# EAGLE design wordclock-r2-grid (EAGLE 5.11)
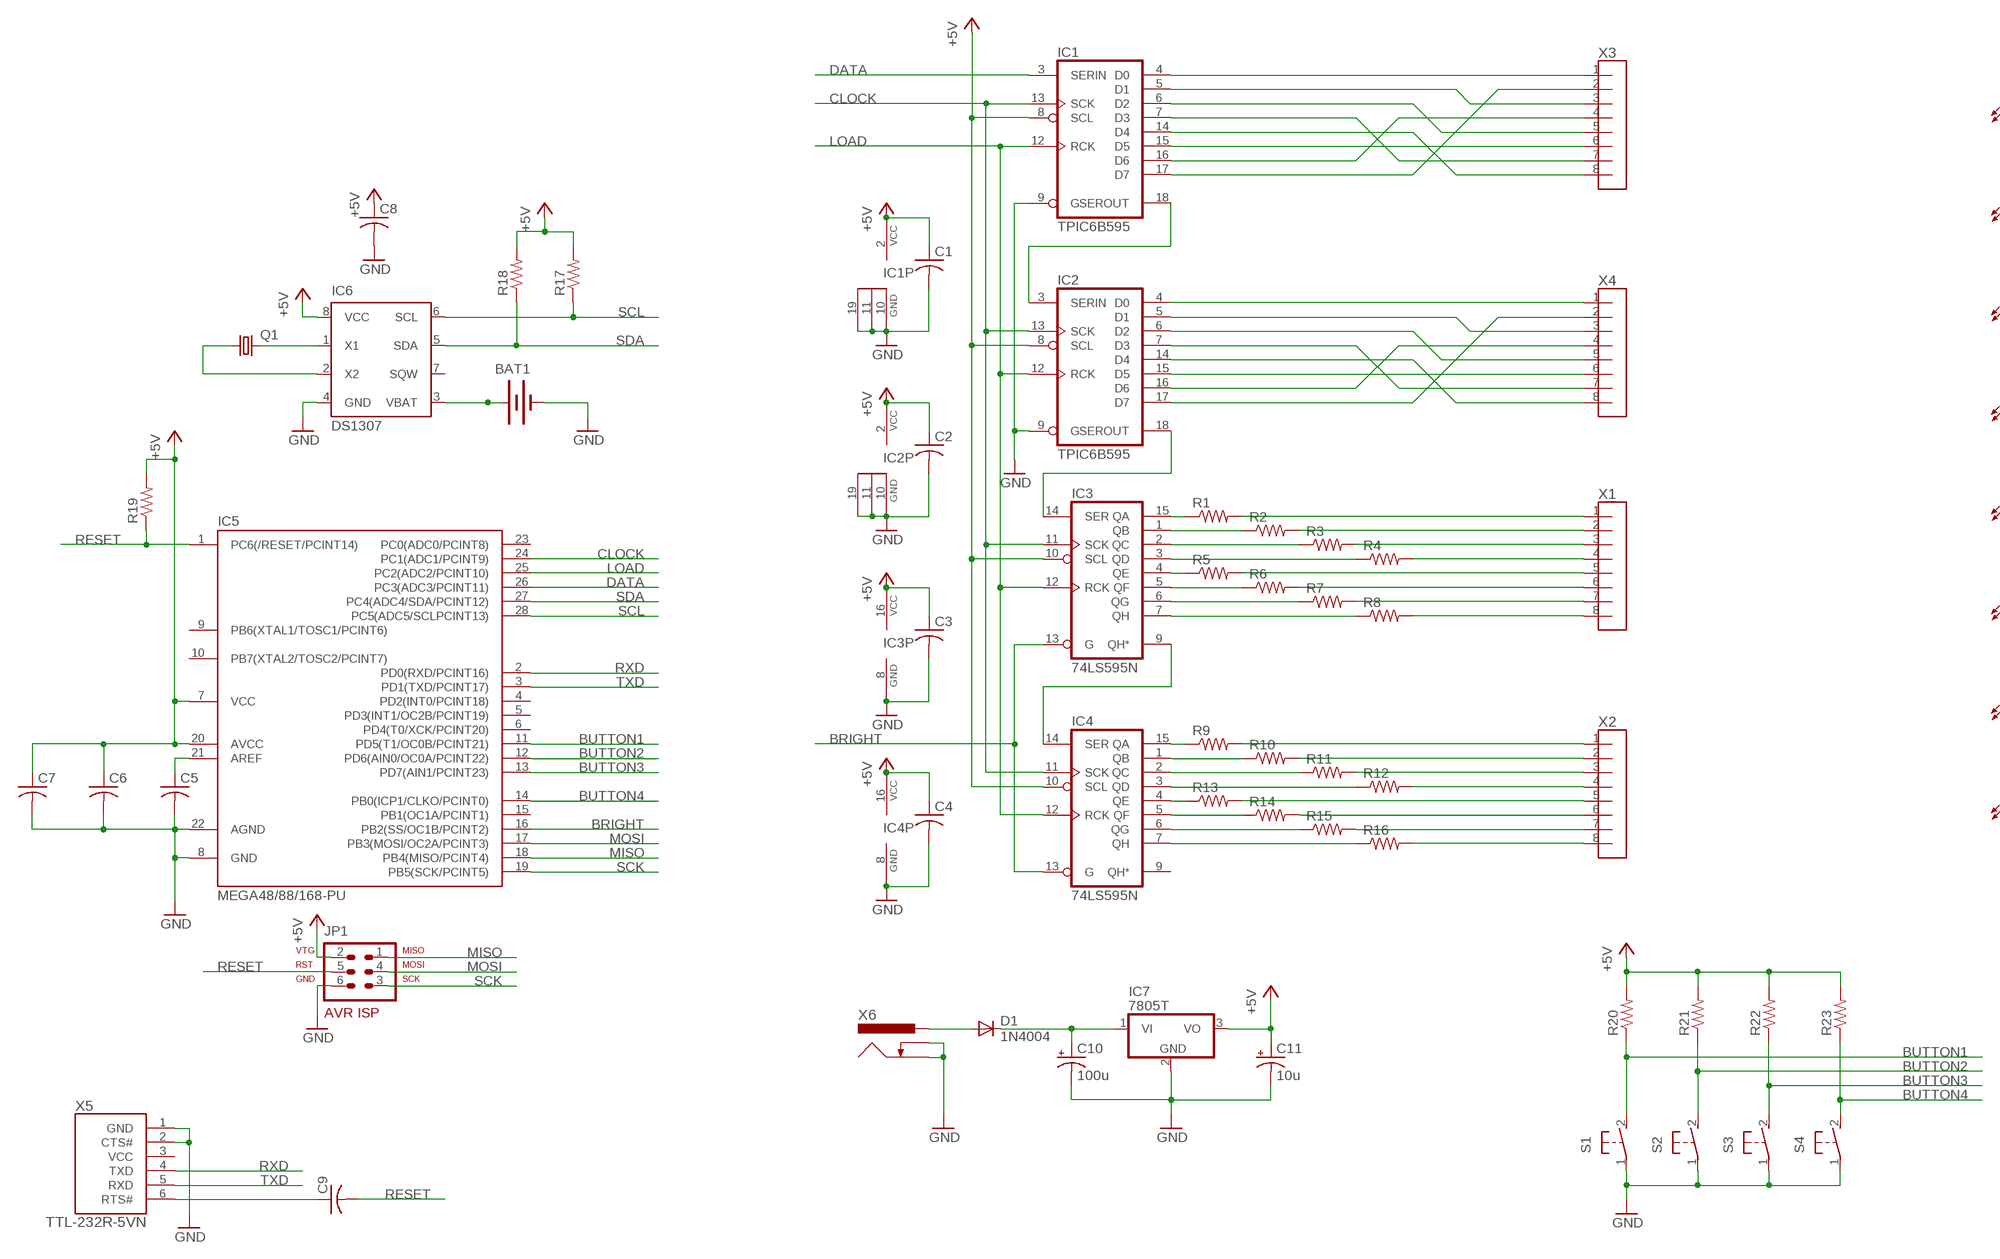
[diagram p0: schematic, sheet 1, part 1 of 2]
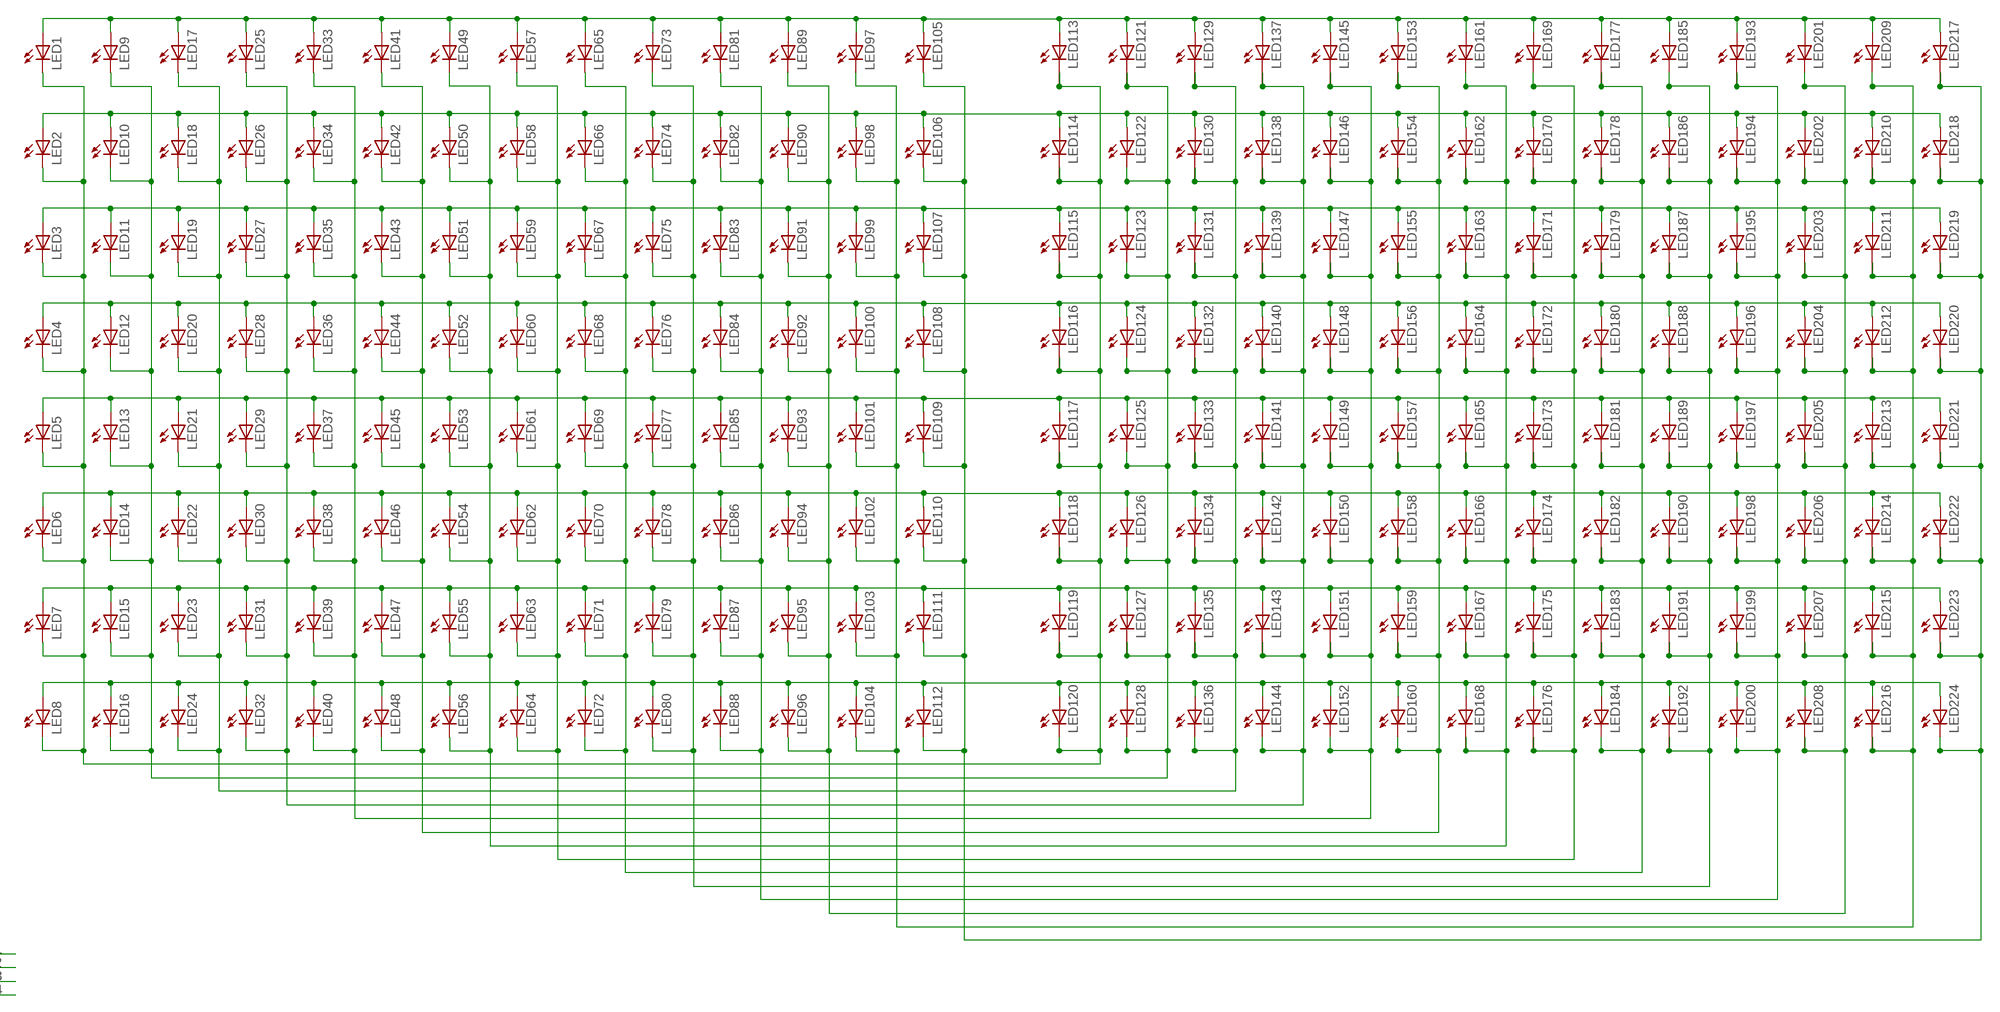
[diagram p1: schematic, sheet 1, part 2 of 2]

## Parts
BAT1  BATTERY12MM  [BATTCON_12MM]
C1  C-US050-025X075  [C050-025X075]
C2  C-US050-025X075  [C050-025X075]
C3  C-US050-025X075  [C050-025X075]
C4  C-US050-025X075  [C050-025X075]
C5  C-US050-025X075  [C050-025X075]
C6  C-US050-025X075  [C050-025X075]
C7  C-US050-025X075  [C050-025X075]
C8  C-US050-025X075  [C050-025X075]
C9  C-US050-025X075  [C050-025X075]
C10  100u  CPOL-USE3.5-8  [E3,5-8]
C11  10u  CPOL-USE2.5-6  [E2,5-6]
D1  1N4004  [DO41-10]
IC1  TPIC6B595  [DIL20]
IC2  TPIC6B595  [DIL20]
IC3  74LS595N  [DIL16]
IC4  74LS595N  [DIL16]
IC5  MEGA48/88/168-PU  [DIL28-3]
IC6  DS1307  [DIL08]
IC7  7805T  [TO220H]
JP1  AVR-ISP-6  [AVR-ISP-6]
LED1  LEDKA-3528ASYC  [KA-3528ASYC]
LED2  LEDKA-3528ASYC  [KA-3528ASYC]
LED3  LEDKA-3528ASYC  [KA-3528ASYC]
LED4  LEDKA-3528ASYC  [KA-3528ASYC]
LED5  LEDKA-3528ASYC  [KA-3528ASYC]
LED6  LEDKA-3528ASYC  [KA-3528ASYC]
LED7  LEDKA-3528ASYC  [KA-3528ASYC]
LED8  LEDKA-3528ASYC  [KA-3528ASYC]
LED9  LEDKA-3528ASYC  [KA-3528ASYC]
LED10  LEDKA-3528ASYC  [KA-3528ASYC]
LED11  LEDKA-3528ASYC  [KA-3528ASYC]
LED12  LEDKA-3528ASYC  [KA-3528ASYC]
LED13  LEDKA-3528ASYC  [KA-3528ASYC]
LED14  LEDKA-3528ASYC  [KA-3528ASYC]
LED15  LEDKA-3528ASYC  [KA-3528ASYC]
LED16  LEDKA-3528ASYC  [KA-3528ASYC]
LED17  LEDKA-3528ASYC  [KA-3528ASYC]
LED18  LEDKA-3528ASYC  [KA-3528ASYC]
LED19  LEDKA-3528ASYC  [KA-3528ASYC]
LED20  LEDKA-3528ASYC  [KA-3528ASYC]
LED21  LEDKA-3528ASYC  [KA-3528ASYC]
LED22  LEDKA-3528ASYC  [KA-3528ASYC]
LED23  LEDKA-3528ASYC  [KA-3528ASYC]
LED24  LEDKA-3528ASYC  [KA-3528ASYC]
LED25  LEDKA-3528ASYC  [KA-3528ASYC]
LED26  LEDKA-3528ASYC  [KA-3528ASYC]
LED27  LEDKA-3528ASYC  [KA-3528ASYC]
LED28  LEDKA-3528ASYC  [KA-3528ASYC]
LED29  LEDKA-3528ASYC  [KA-3528ASYC]
LED30  LEDKA-3528ASYC  [KA-3528ASYC]
LED31  LEDKA-3528ASYC  [KA-3528ASYC]
LED32  LEDKA-3528ASYC  [KA-3528ASYC]
LED33  LEDKA-3528ASYC  [KA-3528ASYC]
LED34  LEDKA-3528ASYC  [KA-3528ASYC]
LED35  LEDKA-3528ASYC  [KA-3528ASYC]
LED36  LEDKA-3528ASYC  [KA-3528ASYC]
LED37  LEDKA-3528ASYC  [KA-3528ASYC]
LED38  LEDKA-3528ASYC  [KA-3528ASYC]
LED39  LEDKA-3528ASYC  [KA-3528ASYC]
LED40  LEDKA-3528ASYC  [KA-3528ASYC]
LED41  LEDKA-3528ASYC  [KA-3528ASYC]
LED42  LEDKA-3528ASYC  [KA-3528ASYC]
LED43  LEDKA-3528ASYC  [KA-3528ASYC]
LED44  LEDKA-3528ASYC  [KA-3528ASYC]
LED45  LEDKA-3528ASYC  [KA-3528ASYC]
LED46  LEDKA-3528ASYC  [KA-3528ASYC]
LED47  LEDKA-3528ASYC  [KA-3528ASYC]
LED48  LEDKA-3528ASYC  [KA-3528ASYC]
LED49  LEDKA-3528ASYC  [KA-3528ASYC]
LED50  LEDKA-3528ASYC  [KA-3528ASYC]
LED51  LEDKA-3528ASYC  [KA-3528ASYC]
LED52  LEDKA-3528ASYC  [KA-3528ASYC]
LED53  LEDKA-3528ASYC  [KA-3528ASYC]
LED54  LEDKA-3528ASYC  [KA-3528ASYC]
LED55  LEDKA-3528ASYC  [KA-3528ASYC]
LED56  LEDKA-3528ASYC  [KA-3528ASYC]
LED57  LEDKA-3528ASYC  [KA-3528ASYC]
LED58  LEDKA-3528ASYC  [KA-3528ASYC]
LED59  LEDKA-3528ASYC  [KA-3528ASYC]
LED60  LEDKA-3528ASYC  [KA-3528ASYC]
LED61  LEDKA-3528ASYC  [KA-3528ASYC]
LED62  LEDKA-3528ASYC  [KA-3528ASYC]
LED63  LEDKA-3528ASYC  [KA-3528ASYC]
LED64  LEDKA-3528ASYC  [KA-3528ASYC]
LED65  LEDKA-3528ASYC  [KA-3528ASYC]
LED66  LEDKA-3528ASYC  [KA-3528ASYC]
LED67  LEDKA-3528ASYC  [KA-3528ASYC]
LED68  LEDKA-3528ASYC  [KA-3528ASYC]
LED69  LEDKA-3528ASYC  [KA-3528ASYC]
LED70  LEDKA-3528ASYC  [KA-3528ASYC]
LED71  LEDKA-3528ASYC  [KA-3528ASYC]
LED72  LEDKA-3528ASYC  [KA-3528ASYC]
LED73  LEDKA-3528ASYC  [KA-3528ASYC]
LED74  LEDKA-3528ASYC  [KA-3528ASYC]
LED75  LEDKA-3528ASYC  [KA-3528ASYC]
LED76  LEDKA-3528ASYC  [KA-3528ASYC]
LED77  LEDKA-3528ASYC  [KA-3528ASYC]
LED78  LEDKA-3528ASYC  [KA-3528ASYC]
LED79  LEDKA-3528ASYC  [KA-3528ASYC]
LED80  LEDKA-3528ASYC  [KA-3528ASYC]
LED81  LEDKA-3528ASYC  [KA-3528ASYC]
LED82  LEDKA-3528ASYC  [KA-3528ASYC]
LED83  LEDKA-3528ASYC  [KA-3528ASYC]
LED84  LEDKA-3528ASYC  [KA-3528ASYC]
LED85  LEDKA-3528ASYC  [KA-3528ASYC]
LED86  LEDKA-3528ASYC  [KA-3528ASYC]
LED87  LEDKA-3528ASYC  [KA-3528ASYC]
LED88  LEDKA-3528ASYC  [KA-3528ASYC]
LED89  LEDKA-3528ASYC  [KA-3528ASYC]
LED90  LEDKA-3528ASYC  [KA-3528ASYC]
LED91  LEDKA-3528ASYC  [KA-3528ASYC]
LED92  LEDKA-3528ASYC  [KA-3528ASYC]
LED93  LEDKA-3528ASYC  [KA-3528ASYC]
LED94  LEDKA-3528ASYC  [KA-3528ASYC]
LED95  LEDKA-3528ASYC  [KA-3528ASYC]
LED96  LEDKA-3528ASYC  [KA-3528ASYC]
LED97  LEDKA-3528ASYC  [KA-3528ASYC]
LED98  LEDKA-3528ASYC  [KA-3528ASYC]
LED99  LEDKA-3528ASYC  [KA-3528ASYC]
LED100  LEDKA-3528ASYC  [KA-3528ASYC]
LED101  LEDKA-3528ASYC  [KA-3528ASYC]
LED102  LEDKA-3528ASYC  [KA-3528ASYC]
LED103  LEDKA-3528ASYC  [KA-3528ASYC]
LED104  LEDKA-3528ASYC  [KA-3528ASYC]
LED105  LEDKA-3528ASYC  [KA-3528ASYC]
LED106  LEDKA-3528ASYC  [KA-3528ASYC]
LED107  LEDKA-3528ASYC  [KA-3528ASYC]
LED108  LEDKA-3528ASYC  [KA-3528ASYC]
LED109  LEDKA-3528ASYC  [KA-3528ASYC]
LED110  LEDKA-3528ASYC  [KA-3528ASYC]
LED111  LEDKA-3528ASYC  [KA-3528ASYC]
LED112  LEDKA-3528ASYC  [KA-3528ASYC]
LED113  LED-2AC-SUPERFLUX  [SUPERFLUX-7.6X7.6]
LED114  LED-2AC-SUPERFLUX  [SUPERFLUX-7.6X7.6]
LED115  LED-2AC-SUPERFLUX  [SUPERFLUX-7.6X7.6]
LED116  LED-2AC-SUPERFLUX  [SUPERFLUX-7.6X7.6]
LED117  LED-2AC-SUPERFLUX  [SUPERFLUX-7.6X7.6]
LED118  LED-2AC-SUPERFLUX  [SUPERFLUX-7.6X7.6]
LED119  LED-2AC-SUPERFLUX  [SUPERFLUX-7.6X7.6]
LED120  LED-2AC-SUPERFLUX  [SUPERFLUX-7.6X7.6]
LED121  LED-2AC-SUPERFLUX  [SUPERFLUX-7.6X7.6]
LED122  LED-2AC-SUPERFLUX  [SUPERFLUX-7.6X7.6]
LED123  LED-2AC-SUPERFLUX  [SUPERFLUX-7.6X7.6]
LED124  LED-2AC-SUPERFLUX  [SUPERFLUX-7.6X7.6]
LED125  LED-2AC-SUPERFLUX  [SUPERFLUX-7.6X7.6]
LED126  LED-2AC-SUPERFLUX  [SUPERFLUX-7.6X7.6]
LED127  LED-2AC-SUPERFLUX  [SUPERFLUX-7.6X7.6]
LED128  LED-2AC-SUPERFLUX  [SUPERFLUX-7.6X7.6]
LED129  LED-2AC-SUPERFLUX  [SUPERFLUX-7.6X7.6]
LED130  LED-2AC-SUPERFLUX  [SUPERFLUX-7.6X7.6]
LED131  LED-2AC-SUPERFLUX  [SUPERFLUX-7.6X7.6]
LED132  LED-2AC-SUPERFLUX  [SUPERFLUX-7.6X7.6]
LED133  LED-2AC-SUPERFLUX  [SUPERFLUX-7.6X7.6]
LED134  LED-2AC-SUPERFLUX  [SUPERFLUX-7.6X7.6]
LED135  LED-2AC-SUPERFLUX  [SUPERFLUX-7.6X7.6]
LED136  LED-2AC-SUPERFLUX  [SUPERFLUX-7.6X7.6]
LED137  LED-2AC-SUPERFLUX  [SUPERFLUX-7.6X7.6]
LED138  LED-2AC-SUPERFLUX  [SUPERFLUX-7.6X7.6]
LED139  LED-2AC-SUPERFLUX  [SUPERFLUX-7.6X7.6]
LED140  LED-2AC-SUPERFLUX  [SUPERFLUX-7.6X7.6]
LED141  LED-2AC-SUPERFLUX  [SUPERFLUX-7.6X7.6]
LED142  LED-2AC-SUPERFLUX  [SUPERFLUX-7.6X7.6]
LED143  LED-2AC-SUPERFLUX  [SUPERFLUX-7.6X7.6]
LED144  LED-2AC-SUPERFLUX  [SUPERFLUX-7.6X7.6]
LED145  LED-2AC-SUPERFLUX  [SUPERFLUX-7.6X7.6]
LED146  LED-2AC-SUPERFLUX  [SUPERFLUX-7.6X7.6]
LED147  LED-2AC-SUPERFLUX  [SUPERFLUX-7.6X7.6]
LED148  LED-2AC-SUPERFLUX  [SUPERFLUX-7.6X7.6]
LED149  LED-2AC-SUPERFLUX  [SUPERFLUX-7.6X7.6]
LED150  LED-2AC-SUPERFLUX  [SUPERFLUX-7.6X7.6]
LED151  LED-2AC-SUPERFLUX  [SUPERFLUX-7.6X7.6]
LED152  LED-2AC-SUPERFLUX  [SUPERFLUX-7.6X7.6]
LED153  LED-2AC-SUPERFLUX  [SUPERFLUX-7.6X7.6]
LED154  LED-2AC-SUPERFLUX  [SUPERFLUX-7.6X7.6]
LED155  LED-2AC-SUPERFLUX  [SUPERFLUX-7.6X7.6]
LED156  LED-2AC-SUPERFLUX  [SUPERFLUX-7.6X7.6]
LED157  LED-2AC-SUPERFLUX  [SUPERFLUX-7.6X7.6]
LED158  LED-2AC-SUPERFLUX  [SUPERFLUX-7.6X7.6]
LED159  LED-2AC-SUPERFLUX  [SUPERFLUX-7.6X7.6]
LED160  LED-2AC-SUPERFLUX  [SUPERFLUX-7.6X7.6]
LED161  LED-2AC-SUPERFLUX  [SUPERFLUX-7.6X7.6]
LED162  LED-2AC-SUPERFLUX  [SUPERFLUX-7.6X7.6]
LED163  LED-2AC-SUPERFLUX  [SUPERFLUX-7.6X7.6]
LED164  LED-2AC-SUPERFLUX  [SUPERFLUX-7.6X7.6]
LED165  LED-2AC-SUPERFLUX  [SUPERFLUX-7.6X7.6]
LED166  LED-2AC-SUPERFLUX  [SUPERFLUX-7.6X7.6]
LED167  LED-2AC-SUPERFLUX  [SUPERFLUX-7.6X7.6]
LED168  LED-2AC-SUPERFLUX  [SUPERFLUX-7.6X7.6]
LED169  LED-2AC-SUPERFLUX  [SUPERFLUX-7.6X7.6]
LED170  LED-2AC-SUPERFLUX  [SUPERFLUX-7.6X7.6]
LED171  LED-2AC-SUPERFLUX  [SUPERFLUX-7.6X7.6]
LED172  LED-2AC-SUPERFLUX  [SUPERFLUX-7.6X7.6]
LED173  LED-2AC-SUPERFLUX  [SUPERFLUX-7.6X7.6]
LED174  LED-2AC-SUPERFLUX  [SUPERFLUX-7.6X7.6]
LED175  LED-2AC-SUPERFLUX  [SUPERFLUX-7.6X7.6]
LED176  LED-2AC-SUPERFLUX  [SUPERFLUX-7.6X7.6]
LED177  LED-2AC-SUPERFLUX  [SUPERFLUX-7.6X7.6]
LED178  LED-2AC-SUPERFLUX  [SUPERFLUX-7.6X7.6]
LED179  LED-2AC-SUPERFLUX  [SUPERFLUX-7.6X7.6]
LED180  LED-2AC-SUPERFLUX  [SUPERFLUX-7.6X7.6]
LED181  LED-2AC-SUPERFLUX  [SUPERFLUX-7.6X7.6]
LED182  LED-2AC-SUPERFLUX  [SUPERFLUX-7.6X7.6]
LED183  LED-2AC-SUPERFLUX  [SUPERFLUX-7.6X7.6]
LED184  LED-2AC-SUPERFLUX  [SUPERFLUX-7.6X7.6]
LED185  LED-2AC-SUPERFLUX  [SUPERFLUX-7.6X7.6]
LED186  LED-2AC-SUPERFLUX  [SUPERFLUX-7.6X7.6]
LED187  LED-2AC-SUPERFLUX  [SUPERFLUX-7.6X7.6]
LED188  LED-2AC-SUPERFLUX  [SUPERFLUX-7.6X7.6]
LED189  LED-2AC-SUPERFLUX  [SUPERFLUX-7.6X7.6]
LED190  LED-2AC-SUPERFLUX  [SUPERFLUX-7.6X7.6]
LED191  LED-2AC-SUPERFLUX  [SUPERFLUX-7.6X7.6]
LED192  LED-2AC-SUPERFLUX  [SUPERFLUX-7.6X7.6]
LED193  LED-2AC-SUPERFLUX  [SUPERFLUX-7.6X7.6]
LED194  LED-2AC-SUPERFLUX  [SUPERFLUX-7.6X7.6]
LED195  LED-2AC-SUPERFLUX  [SUPERFLUX-7.6X7.6]
LED196  LED-2AC-SUPERFLUX  [SUPERFLUX-7.6X7.6]
LED197  LED-2AC-SUPERFLUX  [SUPERFLUX-7.6X7.6]
LED198  LED-2AC-SUPERFLUX  [SUPERFLUX-7.6X7.6]
LED199  LED-2AC-SUPERFLUX  [SUPERFLUX-7.6X7.6]
LED200  LED-2AC-SUPERFLUX  [SUPERFLUX-7.6X7.6]
LED201  LED-2AC-SUPERFLUX  [SUPERFLUX-7.6X7.6]
LED202  LED-2AC-SUPERFLUX  [SUPERFLUX-7.6X7.6]
LED203  LED-2AC-SUPERFLUX  [SUPERFLUX-7.6X7.6]
LED204  LED-2AC-SUPERFLUX  [SUPERFLUX-7.6X7.6]
LED205  LED-2AC-SUPERFLUX  [SUPERFLUX-7.6X7.6]
LED206  LED-2AC-SUPERFLUX  [SUPERFLUX-7.6X7.6]
LED207  LED-2AC-SUPERFLUX  [SUPERFLUX-7.6X7.6]
LED208  LED-2AC-SUPERFLUX  [SUPERFLUX-7.6X7.6]
LED209  LED-2AC-SUPERFLUX  [SUPERFLUX-7.6X7.6]
LED210  LED-2AC-SUPERFLUX  [SUPERFLUX-7.6X7.6]
LED211  LED-2AC-SUPERFLUX  [SUPERFLUX-7.6X7.6]
LED212  LED-2AC-SUPERFLUX  [SUPERFLUX-7.6X7.6]
LED213  LED-2AC-SUPERFLUX  [SUPERFLUX-7.6X7.6]
LED214  LED-2AC-SUPERFLUX  [SUPERFLUX-7.6X7.6]
LED215  LED-2AC-SUPERFLUX  [SUPERFLUX-7.6X7.6]
LED216  LED-2AC-SUPERFLUX  [SUPERFLUX-7.6X7.6]
LED217  LED-2AC-SUPERFLUX  [SUPERFLUX-7.6X7.6]
LED218  LED-2AC-SUPERFLUX  [SUPERFLUX-7.6X7.6]
LED219  LED-2AC-SUPERFLUX  [SUPERFLUX-7.6X7.6]
LED220  LED-2AC-SUPERFLUX  [SUPERFLUX-7.6X7.6]
LED221  LED-2AC-SUPERFLUX  [SUPERFLUX-7.6X7.6]
LED222  LED-2AC-SUPERFLUX  [SUPERFLUX-7.6X7.6]
LED223  LED-2AC-SUPERFLUX  [SUPERFLUX-7.6X7.6]
LED224  LED-2AC-SUPERFLUX  [SUPERFLUX-7.6X7.6]
Q1  CRYSTALTC38H  [TC38H]
R1  R-US_0207/2V  [0207/2V]
R2  R-US_0207/2V  [0207/2V]
R3  R-US_0207/2V  [0207/2V]
R4  R-US_0207/2V  [0207/2V]
R5  R-US_0207/2V  [0207/2V]
R6  R-US_0207/2V  [0207/2V]
R7  R-US_0207/2V  [0207/2V]
R8  R-US_0207/2V  [0207/2V]
R9  R-US_0207/2V  [0207/2V]
R10  R-US_0207/2V  [0207/2V]
R11  R-US_0207/2V  [0207/2V]
R12  R-US_0207/2V  [0207/2V]
R13  R-US_0207/2V  [0207/2V]
R14  R-US_0207/2V  [0207/2V]
R15  R-US_0207/2V  [0207/2V]
R16  R-US_0207/2V  [0207/2V]
R17  R-US_0207/10  [0207/10]
R18  R-US_0207/10  [0207/10]
R19  R-US_0207/10  [0207/10]
R20  R-US_0207/10  [0207/10]
R21  R-US_0207/10  [0207/10]
R22  R-US_0207/10  [0207/10]
R23  R-US_0207/10  [0207/10]
S1  31-XX  [B3F-31XX]
S2  31-XX  [B3F-31XX]
S3  31-XX  [B3F-31XX]
S4  31-XX  [B3F-31XX]
X1  M08-100MIL  [100MIL-8]
X2  M08-100MIL  [100MIL-8]
X3  M08-100MIL  [100MIL-8]
X4  M08-100MIL  [100MIL-8]
X5  TTL-232R-5VN  [USBCABLE-0.100-NOLBL]
X6  PJ-002B  [PJ-002]

## Nets
+5V: C1.1 C2.1 C3.1 C4.1 C6.1 C7.1 C8.1 C11.+ IC1.2(VCC) IC1.8(SCL) IC2.2(VCC) IC2.8(SCL) IC3.10(SCL) IC3.16(VCC) IC4.10(SCL) IC4.16(VCC) IC5.7(VCC) IC5.20(AVCC) IC6.8(VCC) IC7.3(VO) JP1.2 R17.2 R18.2 R19.2 R20.2 R21.2 R22.2 R23.2
BRIGHT: IC3.13(G) IC4.13(G) IC5.16(PB2(SS/OC1B/PCINT2))
BUTTON1: IC5.11(PD5(T1/OC0B/PCINT21)) R20.1 S1.2(S)
BUTTON2: IC5.12(PD6(AIN0/OC0A/PCINT22)) R21.1 S2.2(S)
BUTTON3: IC5.13(PD7(AIN1/PCINT23)) R22.1 S3.2(S)
BUTTON4: IC5.14(PB0(ICP1/CLKO/PCINT0)) R23.1 S4.2(S)
CLOCK: IC1.13(SCK) IC2.13(SCK) IC3.11(SCK) IC4.11(SCK) IC5.24(PC1(ADC1/PCINT9))
DATA: IC1.3(SERIN) IC5.26(PC3(ADC3/PCINT11))
GND: BAT1.GND(-) C1.2 C2.2 C3.2 C4.2 C5.2 C6.2 C7.2 C8.2 C10.- C11.- IC1.9(G) IC1.10(GND) IC1.11(GND1) IC1.19(GND2) IC2.9(G) IC2.10(GND) IC2.11(GND1) IC2.19(GND2) IC3.8(GND) IC4.8(GND) IC5.8(GND) IC5.22(AGND) IC6.4(GND) IC7.2(GND) JP1.6 S1.1(P) S2.1(P) S3.1(P) S4.1(P) X5.1(GND) X5.2(CTS#) X6.2 X6.3
LOAD: IC1.12(RCK) IC2.12(RCK) IC3.12(RCK) IC4.12(RCK) IC5.25(PC2(ADC2/PCINT10))
MISO: IC5.18(PB4(MISO/PCINT4)) JP1.1
MOSI: IC5.17(PB3(MOSI/OC2A/PCINT3)) JP1.4
N$1: R16.2 X2.8
N$2: R15.2 X2.7
N$3: R14.2 X2.6
N$4: IC1.18(SEROUT) IC2.3(SERIN)
N$5: IC2.18(SEROUT) IC3.14(SER)
N$6: IC3.9(QH*) IC4.14(SER)
N$7: IC3.15(QA) R1.1
N$8: IC3.1(QB) R2.1
N$9: IC3.2(QC) R3.1
N$10: IC3.3(QD) R4.1
N$11: IC3.4(QE) R5.1
N$12: IC3.5(QF) R6.1
N$13: IC3.6(QG) R7.1
N$14: IC3.7(QH) R8.1
N$15: C9.1 X5.6(RTS#)
N$16: IC4.15(QA) R9.1
N$17: IC4.1(QB) R10.1
N$18: IC4.2(QC) R11.1
N$19: IC4.3(QD) R12.1
N$20: IC4.4(QE) R13.1
N$21: IC4.5(QF) R14.1
N$22: IC4.6(QG) R15.1
N$23: IC4.7(QH) R16.1
N$24: R13.2 X2.5
N$25: R12.2 X2.4
N$26: R11.2 X2.3
N$27: R10.2 X2.2
N$28: R9.2 X2.1
N$29: R1.2 X1.1
N$30: R2.2 X1.2
N$31: R3.2 X1.3
N$32: R4.2 X1.4
N$33: R5.2 X1.5
N$34: R6.2 X1.6
N$35: R7.2 X1.7
N$36: R8.2 X1.8
N$37: IC6.2(X2) Q1.1
N$38: IC1.4(D0) X3.1
N$39: IC1.17(D7) X3.2
N$40: IC1.5(D1) X3.3
N$41: IC1.16(D6) X3.4
N$42: IC1.6(D2) X3.5
N$43: IC1.15(D5) X3.6
N$44: IC1.7(D3) X3.7
N$45: IC1.14(D4) X3.8
N$46: IC2.14(D4) X4.8
N$47: IC2.7(D3) X4.7
N$48: IC2.15(D5) X4.6
N$49: IC2.6(D2) X4.5
N$50: IC2.16(D6) X4.4
N$51: IC2.5(D1) X4.3
N$52: IC2.17(D7) X4.2
N$53: IC2.4(D0) X4.1
N$54: C5.1 IC5.21(AREF)
N$55: IC6.1(X1) Q1.2
N$56: D1.A X6.1
N$57: C10.+ D1.C IC7.1(VI)
N$58: BAT1.PWR@1(+) IC6.3(VBAT)
N$59: LED1.A LED9.A LED17.A LED25.A LED33.A LED41.A LED49.A LED57.A LED65.A LED73.A LED81.A LED89.A LED97.A LED105.A LED113.2(A) LED121.2(A) LED129.2(A) LED137.2(A) LED145.2(A) LED153.2(A) LED161.2(A) LED169.2(A) LED177.2(A) LED185.2(A) LED193.2(A) LED201.2(A) LED209.2(A) LED217.2(A)
N$61: LED6.A LED14.A LED22.A LED30.A LED38.A LED46.A LED54.A LED62.A LED70.A LED78.A LED86.A LED94.A LED102.A LED110.A LED118.2(A) LED126.2(A) LED134.2(A) LED142.2(A) LED150.2(A) LED158.2(A) LED166.2(A) LED174.2(A) LED182.2(A) LED190.2(A) LED198.2(A) LED206.2(A) LED214.2(A) LED222.2(A)
N$62: LED7.A LED15.A LED23.A LED31.A LED39.A LED47.A LED55.A LED63.A LED71.A LED79.A LED87.A LED95.A LED103.A LED111.A LED119.2(A) LED127.2(A) LED135.2(A) LED143.2(A) LED151.2(A) LED159.2(A) LED167.2(A) LED175.2(A) LED183.2(A) LED191.2(A) LED199.2(A) LED207.2(A) LED215.2(A) LED223.2(A)
N$63: LED8.A LED16.A LED24.A LED32.A LED40.A LED48.A LED56.A LED64.A LED72.A LED80.A LED88.A LED96.A LED104.A LED112.A LED120.2(A) LED128.2(A) LED136.2(A) LED144.2(A) LED152.2(A) LED160.2(A) LED168.2(A) LED176.2(A) LED184.2(A) LED192.2(A) LED200.2(A) LED208.2(A) LED216.2(A) LED224.2(A)
N$65: LED1.C LED2.C LED3.C LED4.C LED5.C LED6.C LED7.C LED8.C LED113.1(C) LED113.3(C) LED114.1(C) LED114.3(C) LED115.1(C) LED115.3(C) LED116.1(C) LED116.3(C) LED117.1(C) LED117.3(C) LED118.1(C) LED118.3(C) LED119.1(C) LED119.3(C) LED120.1(C) LED120.3(C)
N$67: LED9.C LED10.C LED11.C LED12.C LED13.C LED14.C LED15.C LED16.C LED121.1(C) LED121.3(C) LED122.1(C) LED122.3(C) LED123.1(C) LED123.3(C) LED124.1(C) LED124.3(C) LED125.1(C) LED125.3(C) LED126.1(C) LED126.3(C) LED127.1(C) LED127.3(C) LED128.1(C) LED128.3(C)
N$68: LED17.C LED18.C LED19.C LED20.C LED21.C LED22.C LED23.C LED24.C LED129.1(C) LED129.3(C) LED130.1(C) LED130.3(C) LED131.1(C) LED131.3(C) LED132.1(C) LED132.3(C) LED133.1(C) LED133.3(C) LED134.1(C) LED134.3(C) LED135.1(C) LED135.3(C) LED136.1(C) LED136.3(C)
N$70: LED25.C LED26.C LED27.C LED28.C LED29.C LED30.C LED31.C LED32.C LED137.1(C) LED137.3(C) LED138.1(C) LED138.3(C) LED139.1(C) LED139.3(C) LED140.1(C) LED140.3(C) LED141.1(C) LED141.3(C) LED142.1(C) LED142.3(C) LED143.1(C) LED143.3(C) LED144.1(C) LED144.3(C)
N$71: LED33.C LED34.C LED35.C LED36.C LED37.C LED38.C LED39.C LED40.C LED145.1(C) LED145.3(C) LED146.1(C) LED146.3(C) LED147.1(C) LED147.3(C) LED148.1(C) LED148.3(C) LED149.1(C) LED149.3(C) LED150.1(C) LED150.3(C) LED151.1(C) LED151.3(C) LED152.1(C) LED152.3(C)
N$72: LED41.C LED42.C LED43.C LED44.C LED45.C LED46.C LED47.C LED48.C LED153.1(C) LED153.3(C) LED154.1(C) LED154.3(C) LED155.1(C) LED155.3(C) LED156.1(C) LED156.3(C) LED157.1(C) LED157.3(C) LED158.1(C) LED158.3(C) LED159.1(C) LED159.3(C) LED160.1(C) LED160.3(C)
N$73: LED49.C LED50.C LED51.C LED52.C LED53.C LED54.C LED55.C LED56.C LED161.1(C) LED161.3(C) LED162.1(C) LED162.3(C) LED163.1(C) LED163.3(C) LED164.1(C) LED164.3(C) LED165.1(C) LED165.3(C) LED166.1(C) LED166.3(C) LED167.1(C) LED167.3(C) LED168.1(C) LED168.3(C)
N$74: LED57.C LED58.C LED59.C LED60.C LED61.C LED62.C LED63.C LED64.C LED169.1(C) LED169.3(C) LED170.1(C) LED170.3(C) LED171.1(C) LED171.3(C) LED172.1(C) LED172.3(C) LED173.1(C) LED173.3(C) LED174.1(C) LED174.3(C) LED175.1(C) LED175.3(C) LED176.1(C) LED176.3(C)
N$76: LED73.C LED74.C LED75.C LED76.C LED77.C LED78.C LED79.C LED80.C LED185.1(C) LED185.3(C) LED186.1(C) LED186.3(C) LED187.1(C) LED187.3(C) LED188.1(C) LED188.3(C) LED189.1(C) LED189.3(C) LED190.1(C) LED190.3(C) LED191.1(C) LED191.3(C) LED192.1(C) LED192.3(C)
N$78: LED89.C LED90.C LED91.C LED92.C LED93.C LED94.C LED95.C LED96.C LED201.1(C) LED201.3(C) LED202.1(C) LED202.3(C) LED203.1(C) LED203.3(C) LED204.1(C) LED204.3(C) LED205.1(C) LED205.3(C) LED206.1(C) LED206.3(C) LED207.1(C) LED207.3(C) LED208.1(C) LED208.3(C)
N$79: LED97.C LED98.C LED99.C LED100.C LED101.C LED102.C LED103.C LED104.C LED209.1(C) LED209.3(C) LED210.1(C) LED210.3(C) LED211.1(C) LED211.3(C) LED212.1(C) LED212.3(C) LED213.1(C) LED213.3(C) LED214.1(C) LED214.3(C) LED215.1(C) LED215.3(C) LED216.1(C) LED216.3(C)
N$86: LED65.C LED66.C LED67.C LED68.C LED69.C LED70.C LED71.C LED72.C LED177.1(C) LED177.3(C) LED178.1(C) LED178.3(C) LED179.1(C) LED179.3(C) LED180.1(C) LED180.3(C) LED181.1(C) LED181.3(C) LED182.1(C) LED182.3(C) LED183.1(C) LED183.3(C) LED184.1(C) LED184.3(C)
N$88: LED81.C LED82.C LED83.C LED84.C LED85.C LED86.C LED87.C LED88.C LED193.1(C) LED193.3(C) LED194.1(C) LED194.3(C) LED195.1(C) LED195.3(C) LED196.1(C) LED196.3(C) LED197.1(C) LED197.3(C) LED198.1(C) LED198.3(C) LED199.1(C) LED199.3(C) LED200.1(C) LED200.3(C)
N$91: LED105.C LED106.C LED107.C LED108.C LED109.C LED110.C LED111.C LED112.C LED217.1(C) LED217.3(C) LED218.1(C) LED218.3(C) LED219.1(C) LED219.3(C) LED220.1(C) LED220.3(C) LED221.1(C) LED221.3(C) LED222.1(C) LED222.3(C) LED223.1(C) LED223.3(C) LED224.1(C) LED224.3(C)
N$153: LED2.A LED10.A LED18.A LED26.A LED34.A LED42.A LED50.A LED58.A LED66.A LED74.A LED82.A LED90.A LED98.A LED106.A LED114.2(A) LED122.2(A) LED130.2(A) LED138.2(A) LED146.2(A) LED154.2(A) LED162.2(A) LED170.2(A) LED178.2(A) LED186.2(A) LED194.2(A) LED202.2(A) LED210.2(A) LED218.2(A)
N$154: LED3.A LED11.A LED19.A LED27.A LED35.A LED43.A LED51.A LED59.A LED67.A LED75.A LED83.A LED91.A LED99.A LED107.A LED115.2(A) LED123.2(A) LED131.2(A) LED139.2(A) LED147.2(A) LED155.2(A) LED163.2(A) LED171.2(A) LED179.2(A) LED187.2(A) LED195.2(A) LED203.2(A) LED211.2(A) LED219.2(A)
N$155: LED4.A LED12.A LED20.A LED28.A LED36.A LED44.A LED52.A LED60.A LED68.A LED76.A LED84.A LED92.A LED100.A LED108.A LED116.2(A) LED124.2(A) LED132.2(A) LED140.2(A) LED148.2(A) LED156.2(A) LED164.2(A) LED172.2(A) LED180.2(A) LED188.2(A) LED196.2(A) LED204.2(A) LED212.2(A) LED220.2(A)
N$156: LED5.A LED13.A LED21.A LED29.A LED37.A LED45.A LED53.A LED61.A LED69.A LED77.A LED85.A LED93.A LED101.A LED109.A LED117.2(A) LED125.2(A) LED133.2(A) LED141.2(A) LED149.2(A) LED157.2(A) LED165.2(A) LED173.2(A) LED181.2(A) LED189.2(A) LED197.2(A) LED205.2(A) LED213.2(A) LED221.2(A)
RESET: C9.2 IC5.1(PC6(/RESET/PCINT14)) JP1.5 R19.1
RXD: IC5.2(PD0(RXD/PCINT16)) X5.4(TXD)
SCK: IC5.19(PB5(SCK/PCINT5)) JP1.3
SCL: IC5.28(PC5(ADC5/SCLPCINT13)) IC6.6(SCL) R17.1
SDA: IC5.27(PC4(ADC4/SDA/PCINT12)) IC6.5(SDA) R18.1
TXD: IC5.3(PD1(TXD/PCINT17)) X5.5(RXD)
Unconnected: IC4.9(QH*) IC5.4(PD2(INT0/PCINT18)) IC5.5(PD3(INT1/OC2B/PCINT19)) IC5.6(PD4(T0/XCK/PCINT20)) IC5.9(PB6(XTAL1/TOSC1/PCINT6)) IC5.10(PB7(XTAL2/TOSC2/PCINT7)) IC5.15(PB1(OC1A/PCINT1)) IC5.23(PC0(ADC0/PCINT8)) IC6.7(SQW) LED113.4(A) LED114.4(A) LED115.4(A) LED116.4(A) LED117.4(A) LED118.4(A) LED119.4(A) LED120.4(A) LED121.4(A) LED122.4(A) LED123.4(A) LED124.4(A) LED125.4(A) LED126.4(A) LED127.4(A) LED128.4(A) LED129.4(A) LED130.4(A) LED131.4(A) LED132.4(A) LED133.4(A) LED134.4(A) LED135.4(A) LED136.4(A) LED137.4(A) LED138.4(A) LED139.4(A) LED140.4(A) LED141.4(A) LED142.4(A) LED143.4(A) LED144.4(A) LED145.4(A) LED146.4(A) LED147.4(A) LED148.4(A) LED149.4(A) LED150.4(A) LED151.4(A) LED152.4(A) LED153.4(A) LED154.4(A) LED155.4(A) LED156.4(A) LED157.4(A) LED158.4(A) LED159.4(A) LED160.4(A) LED161.4(A) LED162.4(A) LED163.4(A) LED164.4(A) LED165.4(A) LED166.4(A) LED167.4(A) LED168.4(A) LED169.4(A) LED170.4(A) LED171.4(A) LED172.4(A) LED173.4(A) LED174.4(A) LED175.4(A) LED176.4(A) LED177.4(A) LED178.4(A) LED179.4(A) LED180.4(A) LED181.4(A) LED182.4(A) LED183.4(A) LED184.4(A) LED185.4(A) LED186.4(A) LED187.4(A) LED188.4(A) LED189.4(A) LED190.4(A) LED191.4(A) LED192.4(A) LED193.4(A) LED194.4(A) LED195.4(A) LED196.4(A) LED197.4(A) LED198.4(A) LED199.4(A) LED200.4(A) LED201.4(A) LED202.4(A) LED203.4(A) LED204.4(A) LED205.4(A) LED206.4(A) LED207.4(A) LED208.4(A) LED209.4(A) LED210.4(A) LED211.4(A) LED212.4(A) LED213.4(A) LED214.4(A) LED215.4(A) LED216.4(A) LED217.4(A) LED218.4(A) LED219.4(A) LED220.4(A) LED221.4(A) LED222.4(A) LED223.4(A) LED224.4(A) X5.3(VCC)

## Library data of the parts
BAT1 = sfe-sparkfun:BATTERY: Battery Holders Various common sizes : AA, AAA, 20mm coin cell and 12mm coin cell.
C1-C9 = rcl:C-US: CAPACITOR, American symbol
C10 C11 = rcl:CPOL-US: POLARIZED CAPACITOR, American symbol
D1 = diode:1N4004: DIODE general purpose rectifier, 1 A
IC1 IC2 = rbg-ti-powerlogic:TPIC6B595: 8-bit SHIFT REGISTER, output latch, open collector
IC3 IC4 = 74xx-us:74*595: 8-bit SHIFT REGISTER, output latch
IC5 = avr-5-4.16:MEGA48/88/168-PU
IC6 = ds1307_pcf8583:DS1307: I2C-Bus CLOCK/CALENDAR
IC7 = linear:78*: Positive VOLTAGE REGULATOR Source: http://cache.national.com/ds/LM/LM78L05.pdf http://www.fairchildsemi.com/ds/LM/LM7805.pdf
JP1 = avr-5-4.16:AVR-ISP-6: AVR ISP-6 Serial Programming Header
LED1-LED112 = led:LED: LED OSRAM: - CHIPLED LG R971, LG N971, LY N971, LG Q971, LY Q971, LO R971, LY R971 LH N974, LH R974 LS Q976, LO Q976, LY Q976 LO Q996 - Hyper CHIPLED LW Q18S LB Q993, LB Q99A, LB R99A - SideLED LS A670, LO A670, LY A670, LG A670, LP A670 LB A673, LV A673, LT A673, LW A673 LH A674 LY A675 LS A676, LA A676, LO A676, LY A676, LW A676 LS A679, LY A679, LG A679 - Hyper Micro SIDELED® LS Y876, LA Y876, LO Y876, LY Y876 LT Y87S - SmartLED LW L88C, LW L88S LB L89C, LB L89S, LG L890 LS L89K, LO L89K, LY L89K LS L896, LA L896, LO L896, LY L896 - TOPLED LS T670, LO T670, LY T670, LG T670, LP T670 LSG T670, LSP T670, LSY T670, LOP T670, LYG T670 LG T671, LOG T671, LSG T671 LB T673, LV T673, LT T673, LW T673 LH T674 LS T676, LA T676, LO T676, LY T676, LB T676, LH T676, LSB T676, LW T676 LB T67C, LV T67C, LT T67C, LS T67K, LO T67K, LY T67K, LW E67C LS E67B, LA E67B, LO E67B, LY E67B, LB E67C, LV E67C, LT E67C LW T67C LS T679, LY T679, LG T679 LS T770, LO T770, LY T770, LG T770, LP T770 LB T773, LV T773, LT T773, LW T773 LH T774 LS E675, LA E675, LY E675, LS T675 LS T776, LA T776, LO T776, LY T776, LB T776 LHGB T686 LT T68C, LB T68C - Hyper Mini TOPLED® LB M676 - Mini TOPLED Santana® LG M470 LS M47K, LO M47K, LY M47K Source: http://www.osram.convergy.de LUXEON: - LUMILED® LXK2-PW12-R00, LXK2-PW12-S00, LXK2-PW14-U00, LXK2-PW14-V00 LXK2-PM12-R00, LXK2-PM12-S00, LXK2-PM14-U00 LXK2-PE12-Q00, LXK2-PE12-R00, LXK2-PE12-S00, LXK2-PE14-T00, LXK2-PE14-U00 LXK2-PB12-K00, LXK2-PB12-L00, LXK2-PB12-M00, LXK2-PB14-N00, LXK2-PB14-P00, LXK2-PB14-Q00 LXK2-PR12-L00, LXK2-PR12-M00, LXK2-PR14-Q00, LXK2-PR14-R00 LXK2-PD12-Q00, LXK2-PD12-R00, LXK2-PD12-S00 LXK2-PH12-R00, LXK2-PH12-S00 LXK2-PL12-P00, LXK2-PL12-Q00, LXK2-PL12-R00 Source: www.luxeon.com KINGBRIGHT: KA-3528ASYC Source: www.kingbright.com
LED113-LED224 = led:LED-2AC-: LEDs with 2 Cathode & 2 Anode - Kingbright SUPER FLUX LED LAMP Source: www.us.kingbright.com/images/catalog/SPEC/W7676CPBC-H.pdf
Q1 = crystal:CRYSTAL: CRYSTAL
R1-R23 = rcl:R-US_: RESISTOR, American symbol
S1-S4 = switch-omron:31-XX: OMRON SWITCH
X1-X4 = rbg-generic-headers:M08-100MIL
X5 = rbg-ftdi-usb:TTL-232R-5V
X6 = rbg-cui-dcpower:PJ-002

## Board
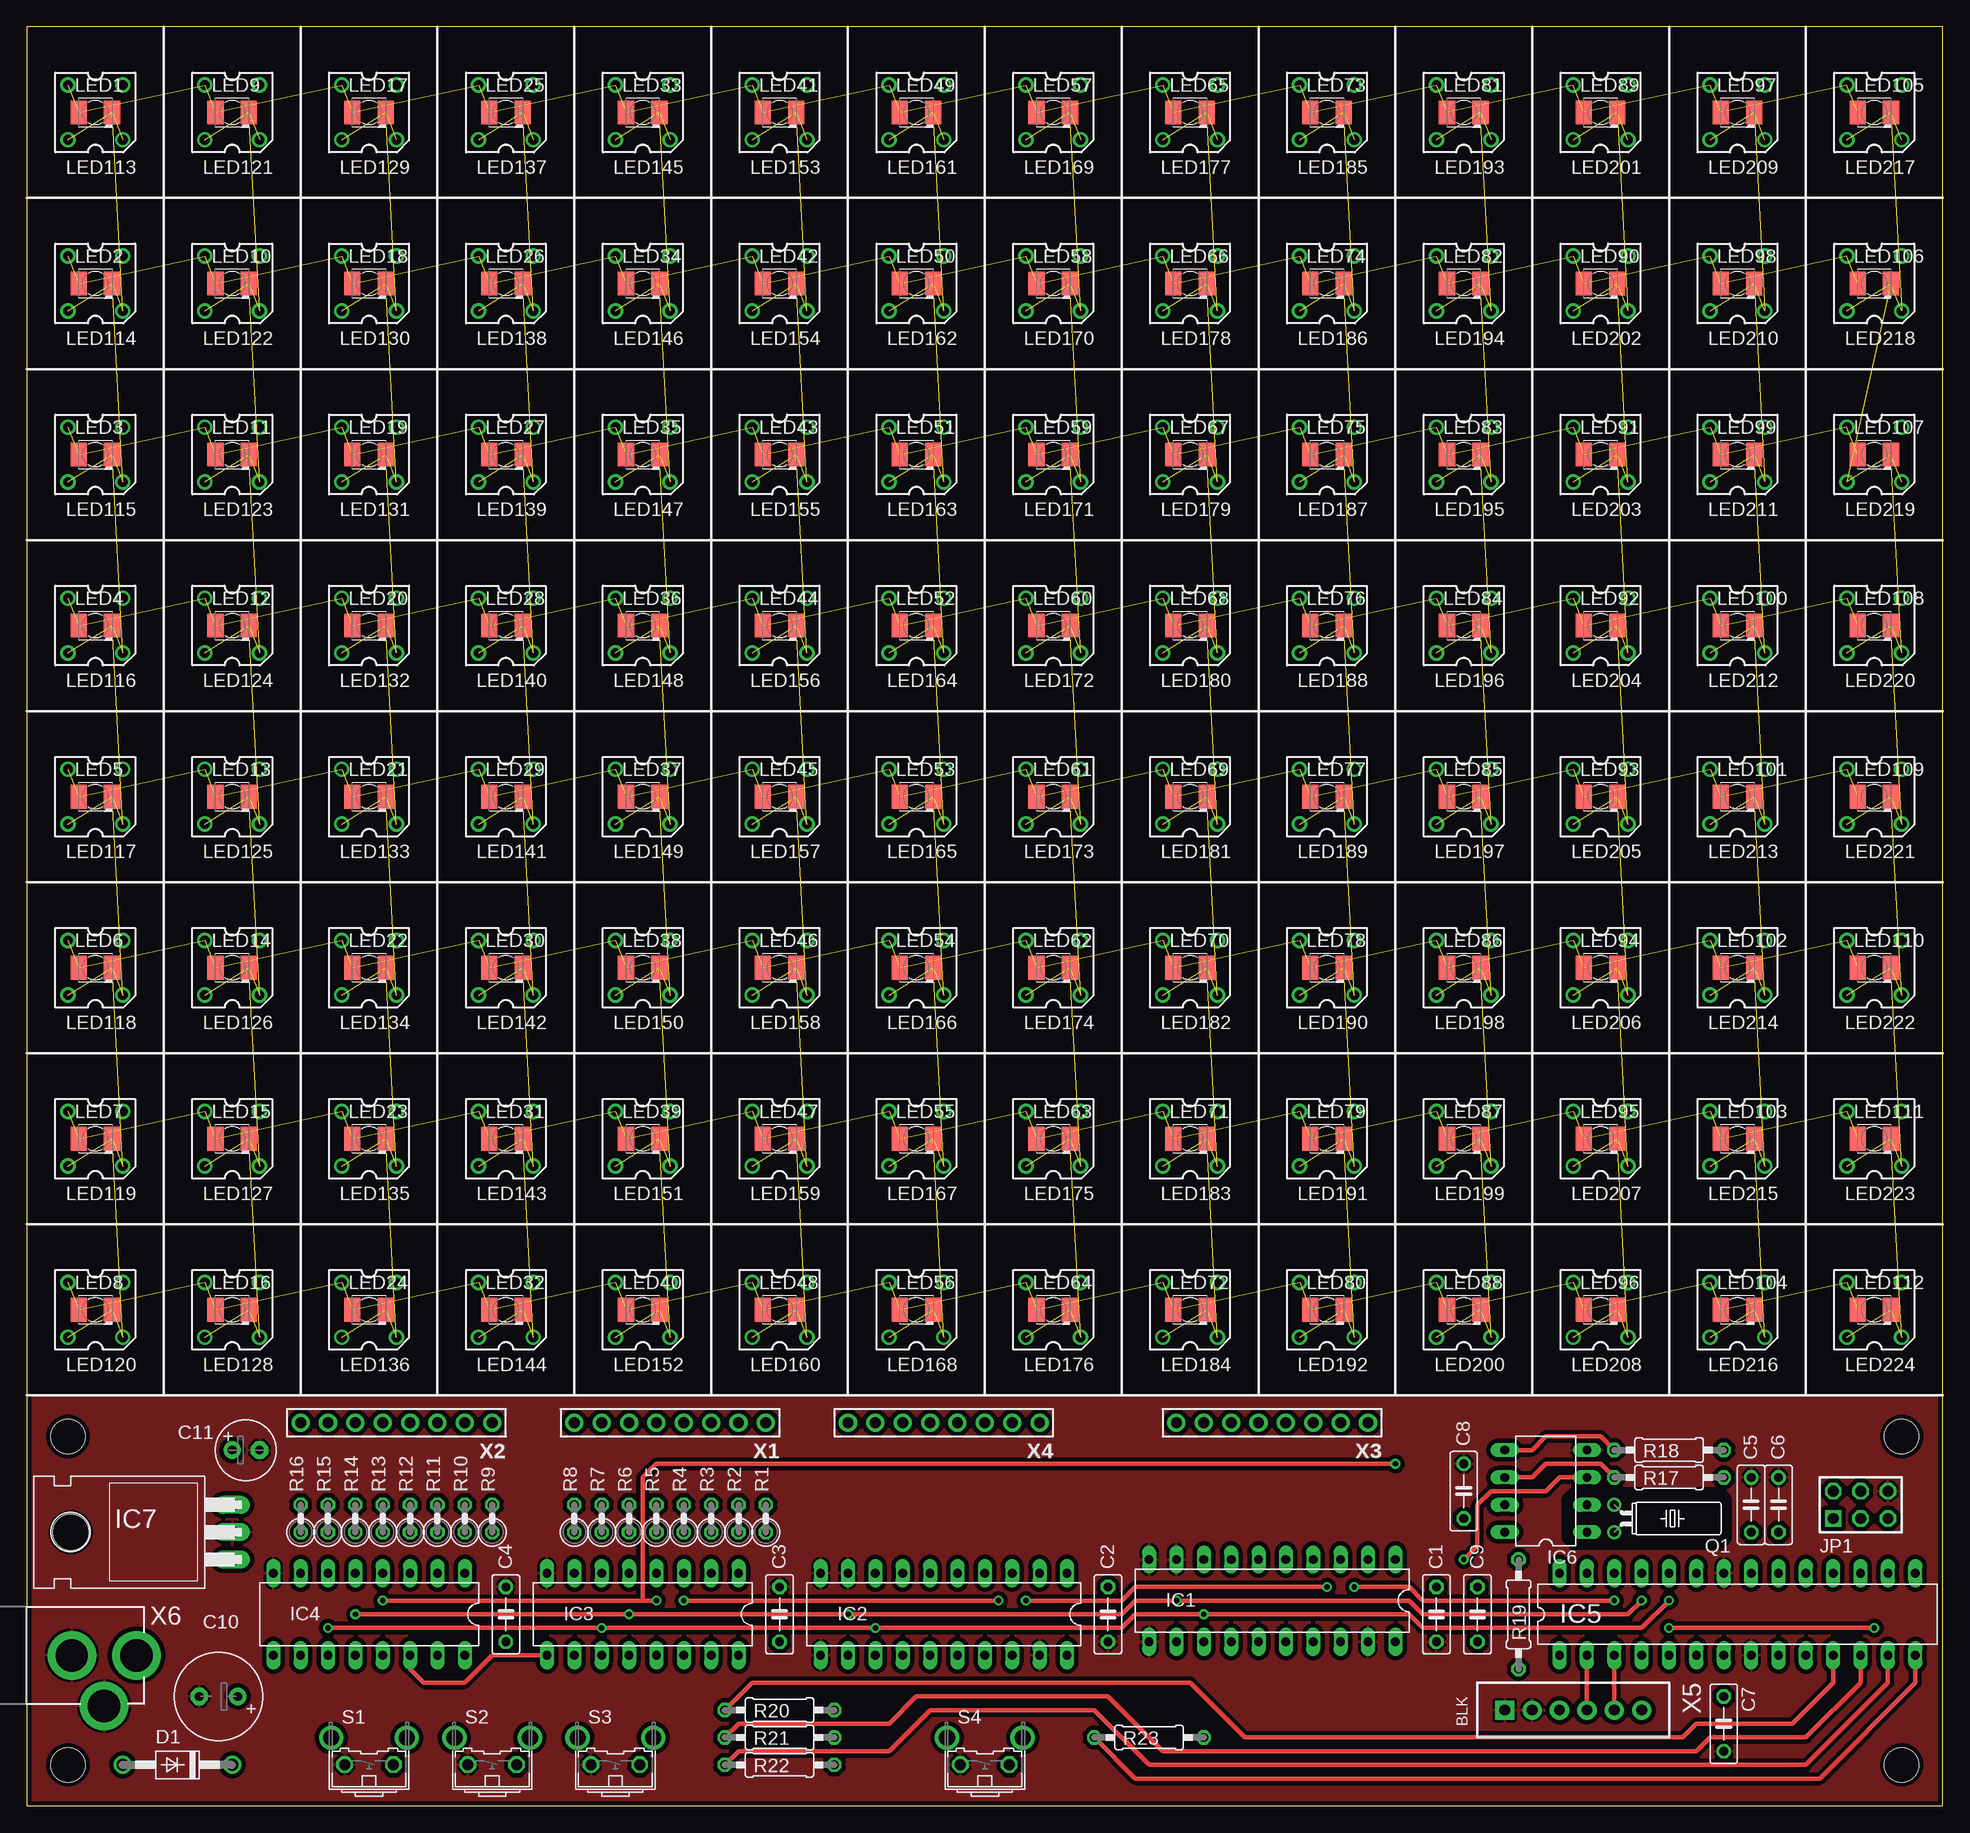
[diagram p2: board, top side]
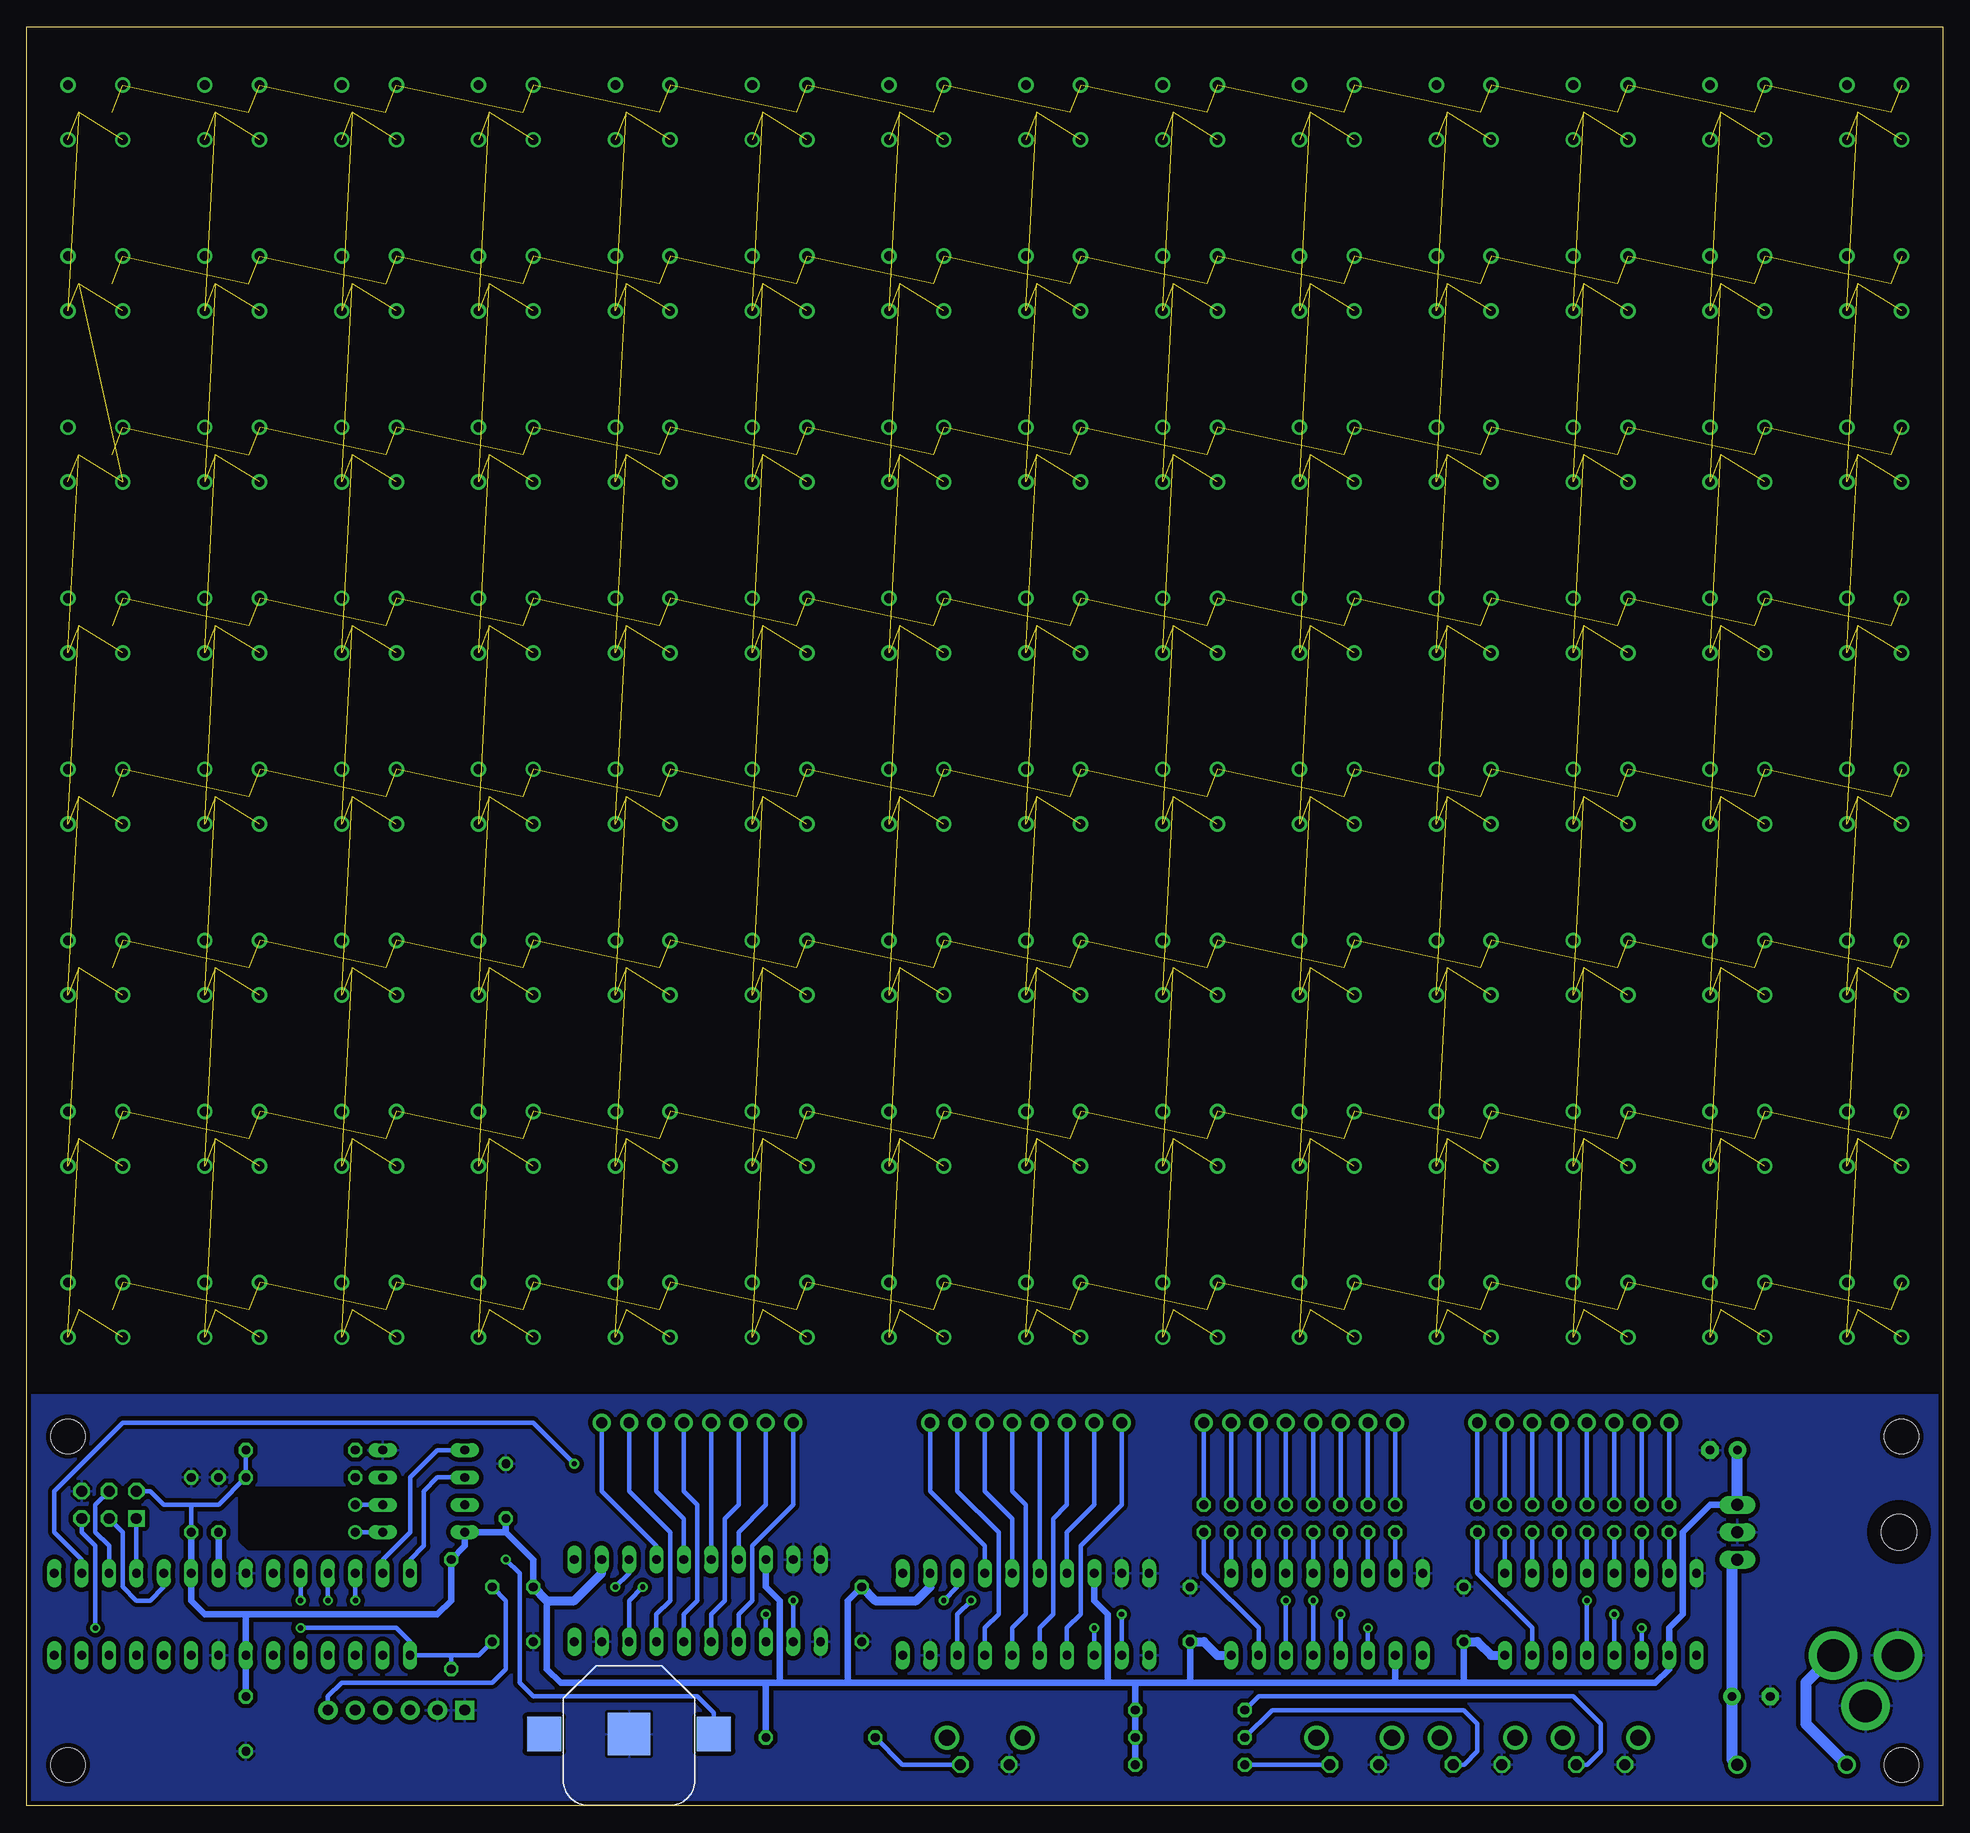
[diagram p3: board, bottom side, seen from below]

Size 177.8 x 165.1 mm. Coordinates in mm from the lower left corner, seen from the top.
Outline: 0,165.1 0,0 177.8,0 177.8,165.1 0,165.1
Copper layers (1*16): Top 0.035mm / dielectric 1.5mm / Bottom 0.035mm
Design rules "default": minimum track width 10mil, minimum drill 19mil, track to track 8mil, track to pad 8mil, pad to pad 8mil, via to via 8mil, smd to smd 8mil, copper to edge 10mil, drill to drill 8mil, minimum pad ring 10mil, minimum via ring 8mil, stop-mask expansion 4mil, vias tented up to drill 0mil, thermal gap 10mil
Holes 3.2 mm at 3.81,34.29 173.99,34.29 173.99,3.81 3.81,3.81
tRestrict: 8 lines
bRestrict: 8 lines

### Footprints (pad centres in the part's own frame; a part is rotated, then mirrored left to right if it is on the bottom)
BATTCON_12MM = smd 3.962 x 3.962: GND 0,0 | smd 3.175 x 3.175: PWR@1 -7.874,0; PWR@2 7.874,0
C050-025X075 = drill 0.813 octagon: 1 -2.54,0; 2 2.54,0
E3,5-8 = drill 0.813 pad 1.6 round: + -1.778,0 | drill 0.813 pad 1.6 octagon: - 1.778,0
E2,5-6 = drill 0.813 pad 1.6 round: + -1.27,0 | drill 0.813 pad 1.6 octagon: - 1.27,0
DO41-10 = drill 1.118 round: A 5.08,0; C -5.08,0
DIL20 = drill 0.813 long: 1 -11.43,-3.81; 2 -8.89,-3.81; 3 -6.35,-3.81; 4 -3.81,-3.81; 5 -1.27,-3.81; 6 1.27,-3.81; 7 3.81,-3.81; 8 6.35,-3.81; 9 8.89,-3.81; 10 11.43,-3.81; 11 11.43,3.81; 12 8.89,3.81; 13 6.35,3.81; 14 3.81,3.81; 15 1.27,3.81; 16 -1.27,3.81; 17 -3.81,3.81; 18 -6.35,3.81; 19 -8.89,3.81; 20 -11.43,3.81
DIL16 = drill 0.813 long: 1 -8.89,-3.81; 2 -6.35,-3.81; 3 -3.81,-3.81; 4 -1.27,-3.81; 5 1.27,-3.81; 6 3.81,-3.81; 7 6.35,-3.81; 8 8.89,-3.81; 9 8.89,3.81; 10 6.35,3.81; 11 3.81,3.81; 12 1.27,3.81; 13 -1.27,3.81; 14 -3.81,3.81; 15 -6.35,3.81; 16 -8.89,3.81
DIL28-3 = drill 0.813 long: 1 -16.51,-3.81; 2 -13.97,-3.81; 3 -11.43,-3.81; 4 -8.89,-3.81; 5 -6.35,-3.81; 6 -3.81,-3.81; 7 -1.27,-3.81; 8 1.27,-3.81; 9 3.81,-3.81; 10 6.35,-3.81; 11 8.89,-3.81; 12 11.43,-3.81; 13 13.97,-3.81; 14 16.51,-3.81; 15 16.51,3.81; 16 13.97,3.81; 17 11.43,3.81; 18 8.89,3.81; 19 6.35,3.81; 20 3.81,3.81; 21 1.27,3.81; 22 -1.27,3.81; 23 -3.81,3.81; 24 -6.35,3.81; 25 -8.89,3.81; 26 -11.43,3.81; 27 -13.97,3.81; 28 -16.51,3.81
DIL08 = drill 0.813 long: 1 -3.81,-3.81; 2 -1.27,-3.81; 3 1.27,-3.81; 4 3.81,-3.81; 5 3.81,3.81; 6 1.27,3.81; 7 -1.27,3.81; 8 -3.81,3.81
TO220H = drill 1.118 long: 1 -2.54,-10.16; 2 0,-10.16; 3 2.54,-10.16 | hole 3.302: 0,4.826
AVR-ISP-6 = drill 1.016 square: 1 -2.54,-1.27 | drill 1.016 octagon: 2 -2.54,1.27; 3 0,-1.27; 4 0,1.27; 5 2.54,-1.27; 6 2.54,1.27
KA-3528ASYC = smd 1.5 x 2.2: A -1.55,0; C 1.55,0
SUPERFLUX-7.6X7.6 = drill 0.9 pad 1.422 round: 1 -2.54,2.54; 2 2.54,2.54; 3 -2.54,-2.54; 4 2.54,-2.54
TC38H = drill 0.813 round: 1 -1.27,0; 2 1.27,0
0207/2V = drill 0.813 octagon: 1 -1.27,0; 2 1.27,0
0207/10 = drill 0.813 octagon: 1 -5.08,0; 2 5.08,0
B3F-31XX = drill 1.016 octagon: 1 -2.261,-1.245; 2 2.261,-1.245 | drill 1.499 pad 2.159 round: 3 -3.505,1.245; 4 3.505,1.245
100MIL-8 = drill 1 pad 1.676 round: 1 -8.89,0; 2 -6.35,0; 3 -3.81,0; 4 -1.27,0; 5 1.27,0; 6 3.81,0; 7 6.35,0; 8 8.89,0
USBCABLE-0.100-NOLBL = drill 1 pad 1.778 square: 1 0,-7.62 | drill 1 pad 1.778 round: 2 0,-5.08; 3 0,-2.54; 4 0,0; 5 0,2.54; 6 0,5.08
PJ-002 = drill 3 pad 4.5 round: 1 0,0; 2 0,6; 3 -4.7,3

### Placement (x,y rotation side)
BAT1  121.92,6.67 180 bottom
C1  130.81,17.78 270 top
C2  100.33,17.78 270 top
C3  69.85,17.78 90 top
C4  44.45,17.78 90 top
C5  160.02,27.94 90 top
C6  162.56,27.94 90 top
C7  157.48,7.62 270 top
C8  133.35,29.21 90 top
C9  134.62,17.78 270 top
C10  17.78,10.16 180 top
C11  20.32,33.02 0 top
D1  13.97,3.81 180 top
IC1  115.57,19.05 180 top
IC2  85.09,17.78 180 top
IC3  57.15,17.78 180 top
IC4  31.75,17.78 180 top
IC5  158.75,17.78 0 top
IC6  140.97,29.21 90 top
IC7  8.89,25.4 90 top
JP1  170.18,27.94 0 top
LED1  6.35,157.16 0 top
LED2  6.35,141.29 0 top
LED3  6.35,125.41 0 top
LED4  6.35,109.54 0 top
LED5  6.35,93.66 0 top
LED6  6.35,77.79 0 top
LED7  6.35,61.91 0 top
LED8  6.35,46.04 0 top
LED9  19.05,157.16 0 top
LED10  19.05,141.29 0 top
LED11  19.05,125.41 0 top
LED12  19.05,109.54 0 top
LED13  19.05,93.66 0 top
LED14  19.05,77.79 0 top
LED15  19.05,61.91 0 top
LED16  19.05,46.04 0 top
LED17  31.75,157.16 0 top
LED18  31.75,141.29 0 top
LED19  31.75,125.41 0 top
LED20  31.75,109.54 0 top
LED21  31.75,93.66 0 top
LED22  31.75,77.79 0 top
LED23  31.75,61.91 0 top
LED24  31.75,46.04 0 top
LED25  44.45,157.16 0 top
LED26  44.45,141.29 0 top
LED27  44.45,125.41 0 top
LED28  44.45,109.54 0 top
LED29  44.45,93.66 0 top
LED30  44.45,77.79 0 top
LED31  44.45,61.91 0 top
LED32  44.45,46.04 0 top
LED33  57.15,157.16 0 top
LED34  57.15,141.29 0 top
LED35  57.15,125.41 0 top
LED36  57.15,109.54 0 top
LED37  57.15,93.66 0 top
LED38  57.15,77.79 0 top
LED39  57.15,61.91 0 top
LED40  57.15,46.04 0 top
LED41  69.85,157.16 0 top
LED42  69.85,141.29 0 top
LED43  69.85,125.41 0 top
LED44  69.85,109.54 0 top
LED45  69.85,93.66 0 top
LED46  69.85,77.79 0 top
LED47  69.85,61.91 0 top
LED48  69.85,46.04 0 top
LED49  82.55,157.16 0 top
LED50  82.55,141.29 0 top
LED51  82.55,125.41 0 top
LED52  82.55,109.54 0 top
LED53  82.55,93.66 0 top
LED54  82.55,77.79 0 top
LED55  82.55,61.91 0 top
LED56  82.55,46.04 0 top
LED57  95.25,157.16 0 top
LED58  95.25,141.29 0 top
LED59  95.25,125.41 0 top
LED60  95.25,109.54 0 top
LED61  95.25,93.66 0 top
LED62  95.25,77.79 0 top
LED63  95.25,61.91 0 top
LED64  95.25,46.04 0 top
LED65  107.95,157.16 0 top
LED66  107.95,141.29 0 top
LED67  107.95,125.41 0 top
LED68  107.95,109.54 0 top
LED69  107.95,93.66 0 top
LED70  107.95,77.79 0 top
LED71  107.95,61.91 0 top
LED72  107.95,46.04 0 top
LED73  120.65,157.16 0 top
LED74  120.65,141.29 0 top
LED75  120.65,125.41 0 top
LED76  120.65,109.54 0 top
LED77  120.65,93.66 0 top
LED78  120.65,77.79 0 top
LED79  120.65,61.91 0 top
LED80  120.65,46.04 0 top
LED81  133.35,157.16 0 top
LED82  133.35,141.29 0 top
LED83  133.35,125.41 0 top
LED84  133.35,109.54 0 top
LED85  133.35,93.66 0 top
LED86  133.35,77.79 0 top
LED87  133.35,61.91 0 top
LED88  133.35,46.04 0 top
LED89  146.05,157.16 0 top
LED90  146.05,141.29 0 top
LED91  146.05,125.41 0 top
LED92  146.05,109.54 0 top
LED93  146.05,93.66 0 top
LED94  146.05,77.79 0 top
LED95  146.05,61.91 0 top
LED96  146.05,46.04 0 top
LED97  158.75,157.16 0 top
LED98  158.75,141.29 0 top
LED99  158.75,125.41 0 top
LED100  158.75,109.54 0 top
LED101  158.75,93.66 0 top
LED102  158.75,77.79 0 top
LED103  158.75,61.91 0 top
LED104  158.75,46.04 0 top
LED105  171.45,157.16 0 top
LED106  171.45,141.29 0 top
LED107  171.45,125.41 0 top
LED108  171.45,109.54 0 top
LED109  171.45,93.66 0 top
LED110  171.45,77.79 0 top
LED111  171.45,61.91 0 top
LED112  171.45,46.04 0 top
LED113  6.35,157.16 90 top
LED114  6.35,141.29 90 top
LED115  6.35,125.41 90 top
LED116  6.35,109.54 90 top
LED117  6.35,93.66 90 top
LED118  6.35,77.79 90 top
LED119  6.35,61.91 90 top
LED120  6.35,46.04 90 top
LED121  19.05,157.16 90 top
LED122  19.05,141.29 90 top
LED123  19.05,125.41 90 top
LED124  19.05,109.54 90 top
LED125  19.05,93.66 90 top
LED126  19.05,77.79 90 top
LED127  19.05,61.91 90 top
LED128  19.05,46.04 90 top
LED129  31.75,157.16 90 top
LED130  31.75,141.29 90 top
LED131  31.75,125.41 90 top
LED132  31.75,109.54 90 top
LED133  31.75,93.66 90 top
LED134  31.75,77.79 90 top
LED135  31.75,61.91 90 top
LED136  31.75,46.04 90 top
LED137  44.45,157.16 90 top
LED138  44.45,141.29 90 top
LED139  44.45,125.41 90 top
LED140  44.45,109.54 90 top
LED141  44.45,93.66 90 top
LED142  44.45,77.79 90 top
LED143  44.45,61.91 90 top
LED144  44.45,46.04 90 top
LED145  57.15,157.16 90 top
LED146  57.15,141.29 90 top
LED147  57.15,125.41 90 top
LED148  57.15,109.54 90 top
LED149  57.15,93.66 90 top
LED150  57.15,77.79 90 top
LED151  57.15,61.91 90 top
LED152  57.15,46.04 90 top
LED153  69.85,157.16 90 top
LED154  69.85,141.29 90 top
LED155  69.85,125.41 90 top
LED156  69.85,109.54 90 top
LED157  69.85,93.66 90 top
LED158  69.85,77.79 90 top
LED159  69.85,61.91 90 top
LED160  69.85,46.04 90 top
LED161  82.55,157.16 90 top
LED162  82.55,141.29 90 top
LED163  82.55,125.41 90 top
LED164  82.55,109.54 90 top
LED165  82.55,93.66 90 top
LED166  82.55,77.79 90 top
LED167  82.55,61.91 90 top
LED168  82.55,46.04 90 top
LED169  95.25,157.16 90 top
LED170  95.25,141.29 90 top
LED171  95.25,125.41 90 top
LED172  95.25,109.54 90 top
LED173  95.25,93.66 90 top
LED174  95.25,77.79 90 top
LED175  95.25,61.91 90 top
LED176  95.25,46.04 90 top
LED177  107.95,157.16 90 top
LED178  107.95,141.29 90 top
LED179  107.95,125.41 90 top
LED180  107.95,109.54 90 top
LED181  107.95,93.66 90 top
LED182  107.95,77.79 90 top
LED183  107.95,61.91 90 top
LED184  107.95,46.04 90 top
LED185  120.65,157.16 90 top
LED186  120.65,141.29 90 top
LED187  120.65,125.41 90 top
LED188  120.65,109.54 90 top
LED189  120.65,93.66 90 top
LED190  120.65,77.79 90 top
LED191  120.65,61.91 90 top
LED192  120.65,46.04 90 top
LED193  133.35,157.16 90 top
LED194  133.35,141.29 90 top
LED195  133.35,125.41 90 top
LED196  133.35,109.54 90 top
LED197  133.35,93.66 90 top
LED198  133.35,77.79 90 top
LED199  133.35,61.91 90 top
LED200  133.35,46.04 90 top
LED201  146.05,157.16 90 top
LED202  146.05,141.29 90 top
LED203  146.05,125.41 90 top
LED204  146.05,109.54 90 top
LED205  146.05,93.66 90 top
LED206  146.05,77.79 90 top
LED207  146.05,61.91 90 top
LED208  146.05,46.04 90 top
LED209  158.75,157.16 90 top
LED210  158.75,141.29 90 top
LED211  158.75,125.41 90 top
LED212  158.75,109.54 90 top
LED213  158.75,93.66 90 top
LED214  158.75,77.79 90 top
LED215  158.75,61.91 90 top
LED216  158.75,46.04 90 top
LED217  171.45,157.16 90 top
LED218  171.45,141.29 90 top
LED219  171.45,125.41 90 top
LED220  171.45,109.54 90 top
LED221  171.45,93.66 90 top
LED222  171.45,77.79 90 top
LED223  171.45,61.91 90 top
LED224  171.45,46.04 90 top
Q1  147.32,26.67 270 top
R1  68.58,26.67 90 top
R2  66.04,26.67 90 top
R3  63.5,26.67 90 top
R4  60.96,26.67 90 top
R5  58.42,26.67 90 top
R6  55.88,26.67 90 top
R7  53.34,26.67 90 top
R8  50.8,26.67 90 top
R9  43.18,26.67 90 top
R10  40.64,26.67 90 top
R11  38.1,26.67 90 top
R12  35.56,26.67 90 top
R13  33.02,26.67 90 top
R14  30.48,26.67 90 top
R15  27.94,26.67 90 top
R16  25.4,26.67 90 top
R17  152.4,30.48 0 top
R18  152.4,33.02 0 top
R19  138.43,17.78 90 top
R20  69.85,8.89 0 top
R21  69.85,6.35 0 top
R22  69.85,3.81 0 top
R23  104.14,6.35 0 top
S1  31.75,5.08 0 top
S2  43.18,5.08 0 top
S3  54.61,5.08 0 top
S4  88.9,5.08 0 top
X1  59.69,35.56 180 top
X2  34.29,35.56 180 top
X3  115.57,35.56 180 top
X4  85.09,35.56 180 top
X5  144.78,8.89 270 top
X6  10.16,13.97 90 top

### Tracks (layer width: path | path; a pad name or v marks a point on that pad's centre or on a via)
+5V
  Bottom 0.406: R18.2 R17.2 160.02,27.94 162.56,27.94 | C6.1 162.56,27.94 | 162.56,27.94 165.1,27.94 166.37,29.21 JP1.2
  Bottom 0.61: 44.45,11.43 26.67,11.43 25.4,12.7 IC4.10 25.4,16.51 24.13,17.78 24.13,25.4 21.59,27.94 IC7.3 | 44.45,11.43 50.8,11.43 | 50.8,11.43 69.85,11.43 | 69.85,11.43 74.93,11.43 | 74.93,11.43 77.47,11.43 | 77.47,11.43 101.6,11.43 | 101.6,11.43 107.95,11.43 | C2.1 101.6,19.05 101.6,11.43 | 69.85,11.43 C3.1 | 44.45,11.43 C4.1 | 50.8,11.43 IC3.10 | IC2.8 78.74,19.05 77.47,17.78 77.47,11.43 | IC1.8 109.22,20.32 107.95,19.05 107.95,11.43 | C7.1 IC5.7 157.48,17.78 | C6.1 IC5.20 162.56,19.05 161.29,17.78 157.48,17.78 | 107.95,11.43 109.22,11.43 | 109.22,11.43 128.27,11.43 129.54,12.7 129.54,19.05 | C1.1 130.81,22.86 133.35,25.4 | 133.35,25.4 IC6.8 137.16,24.13 R19.2 138.43,19.05 139.7,17.78 157.48,17.78 | 133.35,25.4 C8.1 | R22.2 R21.2 R20.2 74.93,11.43 | 109.22,11.43 R23.2
  Bottom 0.813: C4.1 43.18,15.24 41.91,13.97 IC4.16 | C3.1 68.58,15.24 67.31,13.97 IC3.16 | IC2.2 93.98,20.32 95.25,19.05 99.06,19.05 C2.1 | IC1.2 124.46,21.59 127,19.05 129.54,19.05 C1.1
  Bottom 1.016: IC7.3 C11.+
BRIGHT  (via drill 0.5)
  Top 0.406: v33.02,19.05 57.15,19.05 | 57.15,19.05 v58.42,19.05 | v127,31.75 58.42,31.75 57.15,30.48 57.15,19.05
  Bottom 0.406: v58.42,19.05 IC3.13 | IC4.13 v33.02,19.05 | IC5.16 172.72,22.86 175.26,25.4 175.26,29.21 168.91,35.56 130.81,35.56 v127,31.75
BUTTON1
  Top 0.406: IC5.11 167.64,11.43 163.83,7.62 154.94,7.62 153.67,6.35 113.03,6.35 107.95,11.43 67.31,11.43 R20.1
  Bottom 0.406: R20.1 63.5,10.16 34.29,10.16 31.75,7.62 31.75,5.08 32.99,3.84 S1.2
BUTTON2
  Top 0.406: IC5.12 170.18,11.43 165.1,6.35 156.21,6.35 154.94,5.08 105.41,5.08 100.33,10.16 82.55,10.16 80.01,7.62 66.04,7.62 R21.1
  Bottom 0.406: R21.1 62.23,8.89 44.45,8.89 43.18,7.62 43.18,5.08 44.42,3.84 S2.2
BUTTON3
  Top 0.406: IC5.13 172.72,11.43 165.1,3.81 104.14,3.81 99.06,8.89 83.82,8.89 80.01,5.08 66.04,5.08 R22.1
  Bottom 0.406: S3.2 57.12,3.84 57.15,3.81 R22.1
BUTTON4
  Top 0.406: IC5.14 175.26,11.43 166.37,2.54 102.87,2.54 R23.1
  Bottom 0.406: S4.2 96.55,3.84 R23.1
CLOCK  (via drill 0.5)
  Top 0.406: v27.94,16.51 v53.34,16.51 v78.74,16.51 101.6,16.51 102.87,17.78 v109.22,17.78 128.27,17.78 129.54,16.51 149.86,16.51 v152.4,19.05
  Bottom 0.406: IC4.11 v27.94,16.51 | v109.22,17.78 IC1.13 | v53.34,16.51 IC3.11 | v78.74,16.51 IC2.13 | v152.4,19.05 IC5.24
DATA  (via drill 0.5)
  Top 0.406: v123.19,20.32 128.27,20.32 129.54,19.05 v147.32,19.05
  Bottom 0.406: IC1.3 121.92,21.59 v123.19,20.32 | v147.32,19.05 IC5.26
GND
  pour Bottom (isolate 0.406): -1.27,38.1 179.07,38.1 179.07,-1.27 -1.27,-1.27
  pour Top (isolate 0.406): -1.27,38.1 179.07,38.1 179.07,-1.27 -1.27,-1.27
LOAD  (via drill 0.5)
  Top 0.406: v30.48,17.78 v55.88,17.78 v76.2,17.78 101.6,17.78 102.87,19.05 v106.68,19.05 128.27,19.05 129.54,17.78 148.59,17.78 v149.86,19.05
  Bottom 0.406: IC4.12 v30.48,17.78 | v106.68,19.05 IC1.12 | v76.2,17.78 IC2.12 | v55.88,17.78 IC3.12 | v149.86,19.05 IC5.25
MISO
  Bottom 0.406: IC5.18 JP1.1
MOSI
  Bottom 0.406: IC5.17 170.18,24.13 171.45,25.4 171.45,27.94 JP1.4
N$1
  Bottom 0.406: R16.2 X2.8
N$2
  Bottom 0.406: R15.2 X2.7
N$3
  Bottom 0.406: R14.2 X2.6
N$4  (via drill 0.5)
  Top 0.406: v92.71,19.05 101.6,19.05 102.87,20.32 v120.65,20.32
  Bottom 0.406: v120.65,20.32 121.92,19.05 IC1.18 | v92.71,19.05 91.44,20.32 IC2.3
N$5  (via drill 0.5)
  Top 0.406: v60.96,19.05 v90.17,19.05
  Bottom 0.406: IC2.18 91.44,17.78 v90.17,19.05 | IC3.14 v60.96,19.05
N$6
  Top 0.406: IC3.9 43.18,13.97 40.64,11.43 36.83,11.43 35.56,12.7 IC4.14
N$7
  Bottom 0.406: IC3.15 63.5,16.51 68.58,21.59 R1.1
N$8
  Bottom 0.406: IC3.1 R2.1
N$9
  Bottom 0.406: IC3.2 R3.1
N$10
  Bottom 0.406: IC3.3 R4.1
N$11
  Bottom 0.406: IC3.4 R5.1
N$12
  Bottom 0.406: IC3.5 R6.1
N$13
  Bottom 0.406: IC3.6 R7.1
N$14
  Bottom 0.406: IC3.7 R8.1
N$15
  Bottom 0.406: C9.1 133.35,19.05 133.35,12.7 134.62,11.43 148.59,11.43 149.86,10.16 X5.6
N$16
  Bottom 0.406: IC4.15 38.1,16.51 43.18,21.59 R9.1
N$17
  Bottom 0.406: IC4.1 R10.1
N$18
  Bottom 0.406: IC4.2 R11.1
N$19
  Bottom 0.406: IC4.3 R12.1
N$20
  Bottom 0.406: IC4.4 R13.1
N$21
  Bottom 0.406: IC4.5 R14.1
N$22
  Bottom 0.406: IC4.6 R15.1
N$23
  Bottom 0.406: IC4.7 R16.1
N$24
  Bottom 0.406: R13.2 X2.5
N$25
  Bottom 0.406: R12.2 X2.4
N$26
  Bottom 0.406: R11.2 X2.3
N$27
  Bottom 0.406: R10.2 X2.2
N$28
  Bottom 0.406: R9.2 X2.1
N$29
  Bottom 0.406: R1.2 X1.1
N$30
  Bottom 0.406: R2.2 X1.2
N$31
  Bottom 0.406: R3.2 X1.3
N$32
  Bottom 0.406: R4.2 X1.4
N$33
  Bottom 0.406: R5.2 X1.5
N$34
  Bottom 0.406: R6.2 X1.6
N$35
  Bottom 0.406: R7.2 X1.7
N$36
  Bottom 0.406: R8.2 X1.8
N$37
  Bottom 0.406: IC6.2 Q1.1
N$38
  Bottom 0.406: IC1.4 119.38,24.13 124.46,29.21 X3.1
N$39
  Bottom 0.406: IC1.17 119.38,17.78 118.11,19.05 118.11,25.4 121.92,29.21 X3.2
N$40
  Bottom 0.406: IC1.5 116.84,26.67 119.38,29.21 X3.3
N$41
  Bottom 0.406: IC1.16 116.84,17.78 115.57,19.05 115.57,27.94 116.84,29.21 X3.4
N$42
  Bottom 0.406: IC1.6 X3.5
N$43
  Bottom 0.406: X3.6 111.76,27.94 113.03,26.67 113.03,19.05 114.3,17.78 IC1.15
N$44
  Bottom 0.406: IC1.7 111.76,25.4 109.22,27.94 X3.7
N$45
  Bottom 0.406: IC1.14 111.76,17.78 110.49,19.05 110.49,24.13 106.68,27.94 X3.8
N$46
  Bottom 0.406: IC2.14 81.28,16.51 80.01,17.78 80.01,24.13 76.2,27.94 X4.8
N$47
  Bottom 0.406: IC2.7 81.28,25.4 78.74,27.94 X4.7
N$48
  Bottom 0.406: IC2.15 83.82,16.51 82.55,17.78 82.55,26.67 81.28,27.94 X4.6
N$49
  Bottom 0.406: IC2.6 X4.5
N$50
  Bottom 0.406: IC2.16 86.36,16.51 85.09,17.78 85.09,27.94 86.36,29.21 X4.4
N$51
  Bottom 0.406: IC2.5 86.36,26.67 88.9,29.21 X4.3
N$52
  Bottom 0.406: IC2.17 88.9,16.51 87.63,17.78 87.63,25.4 91.44,29.21 X4.2
N$53
  Bottom 0.406: IC2.4 88.9,24.13 93.98,29.21 X4.1
N$54
  Bottom 0.61: IC5.21 C5.1
N$55
  Bottom 0.406: IC6.1 Q1.2
N$56
  Bottom 1.016: X6.1 12.7,11.43 12.7,7.62 D1.A
N$57
  Bottom 1.016: D1.C 19.56,4.32 C10.+ 19.56,22.35 IC7.1
N$58  (via drill 0.5)
  Top 0.406: v133.35,22.86 134.62,24.13 134.62,27.94 135.89,29.21 140.97,29.21 142.24,30.48 IC6.3
  Bottom 0.406: BAT1.PWR@1 114.05,8.64 115.57,10.16 130.81,10.16 132.08,11.43 132.08,21.59 v133.35,22.86
N$59  (27 unrouted)
N$61  (27 unrouted)
N$62  (27 unrouted)
N$63  (27 unrouted)
N$65  (23 unrouted)
N$67  (23 unrouted)
N$68  (23 unrouted)
N$70  (23 unrouted)
N$71  (23 unrouted)
N$72  (23 unrouted)
N$73  (23 unrouted)
N$74  (23 unrouted)
N$76  (23 unrouted)
N$78  (23 unrouted)
N$79  (23 unrouted)
N$86  (23 unrouted)
N$88  (23 unrouted)
N$91  (23 unrouted)
N$153  (27 unrouted)
N$154  (27 unrouted)
N$155  (27 unrouted)
N$156  (27 unrouted)
RESET  (via drill 0.5)
  Top 0.406: v152.4,16.51 v171.45,16.51
  Bottom 0.406: 138.43,13.97 IC5.1 142.24,15.24 143.51,16.51 v152.4,16.51 | 138.43,13.97 R19.1 | v171.45,16.51 171.45,24.13 172.72,25.4 JP1.5 | C9.2 135.89,13.97 138.43,13.97
RXD
  Top 0.406: X5.4 IC5.2
SCK
  Bottom 0.406: JP1.3 168.91,25.4 168.91,20.32 167.64,19.05 166.37,19.05 165.1,20.32 IC5.19
SCL
  Top 0.406: R17.1 146.05,31.75 140.97,31.75 139.7,30.48 IC6.6
  Bottom 0.406: IC5.28 142.24,22.86 140.97,24.13 140.97,29.21 139.7,30.48 IC6.6
SDA
  Top 0.406: R18.1 146.05,34.29 140.97,34.29 139.7,33.02 IC6.5
  Bottom 0.406: IC5.27 144.78,22.86 142.24,25.4 142.24,30.48 139.7,33.02 IC6.5
TXD
  Top 0.406: X5.5 IC5.3